# Altium project Beta_Prototype_Main_Board.PrjPcb (part 1 of 2)
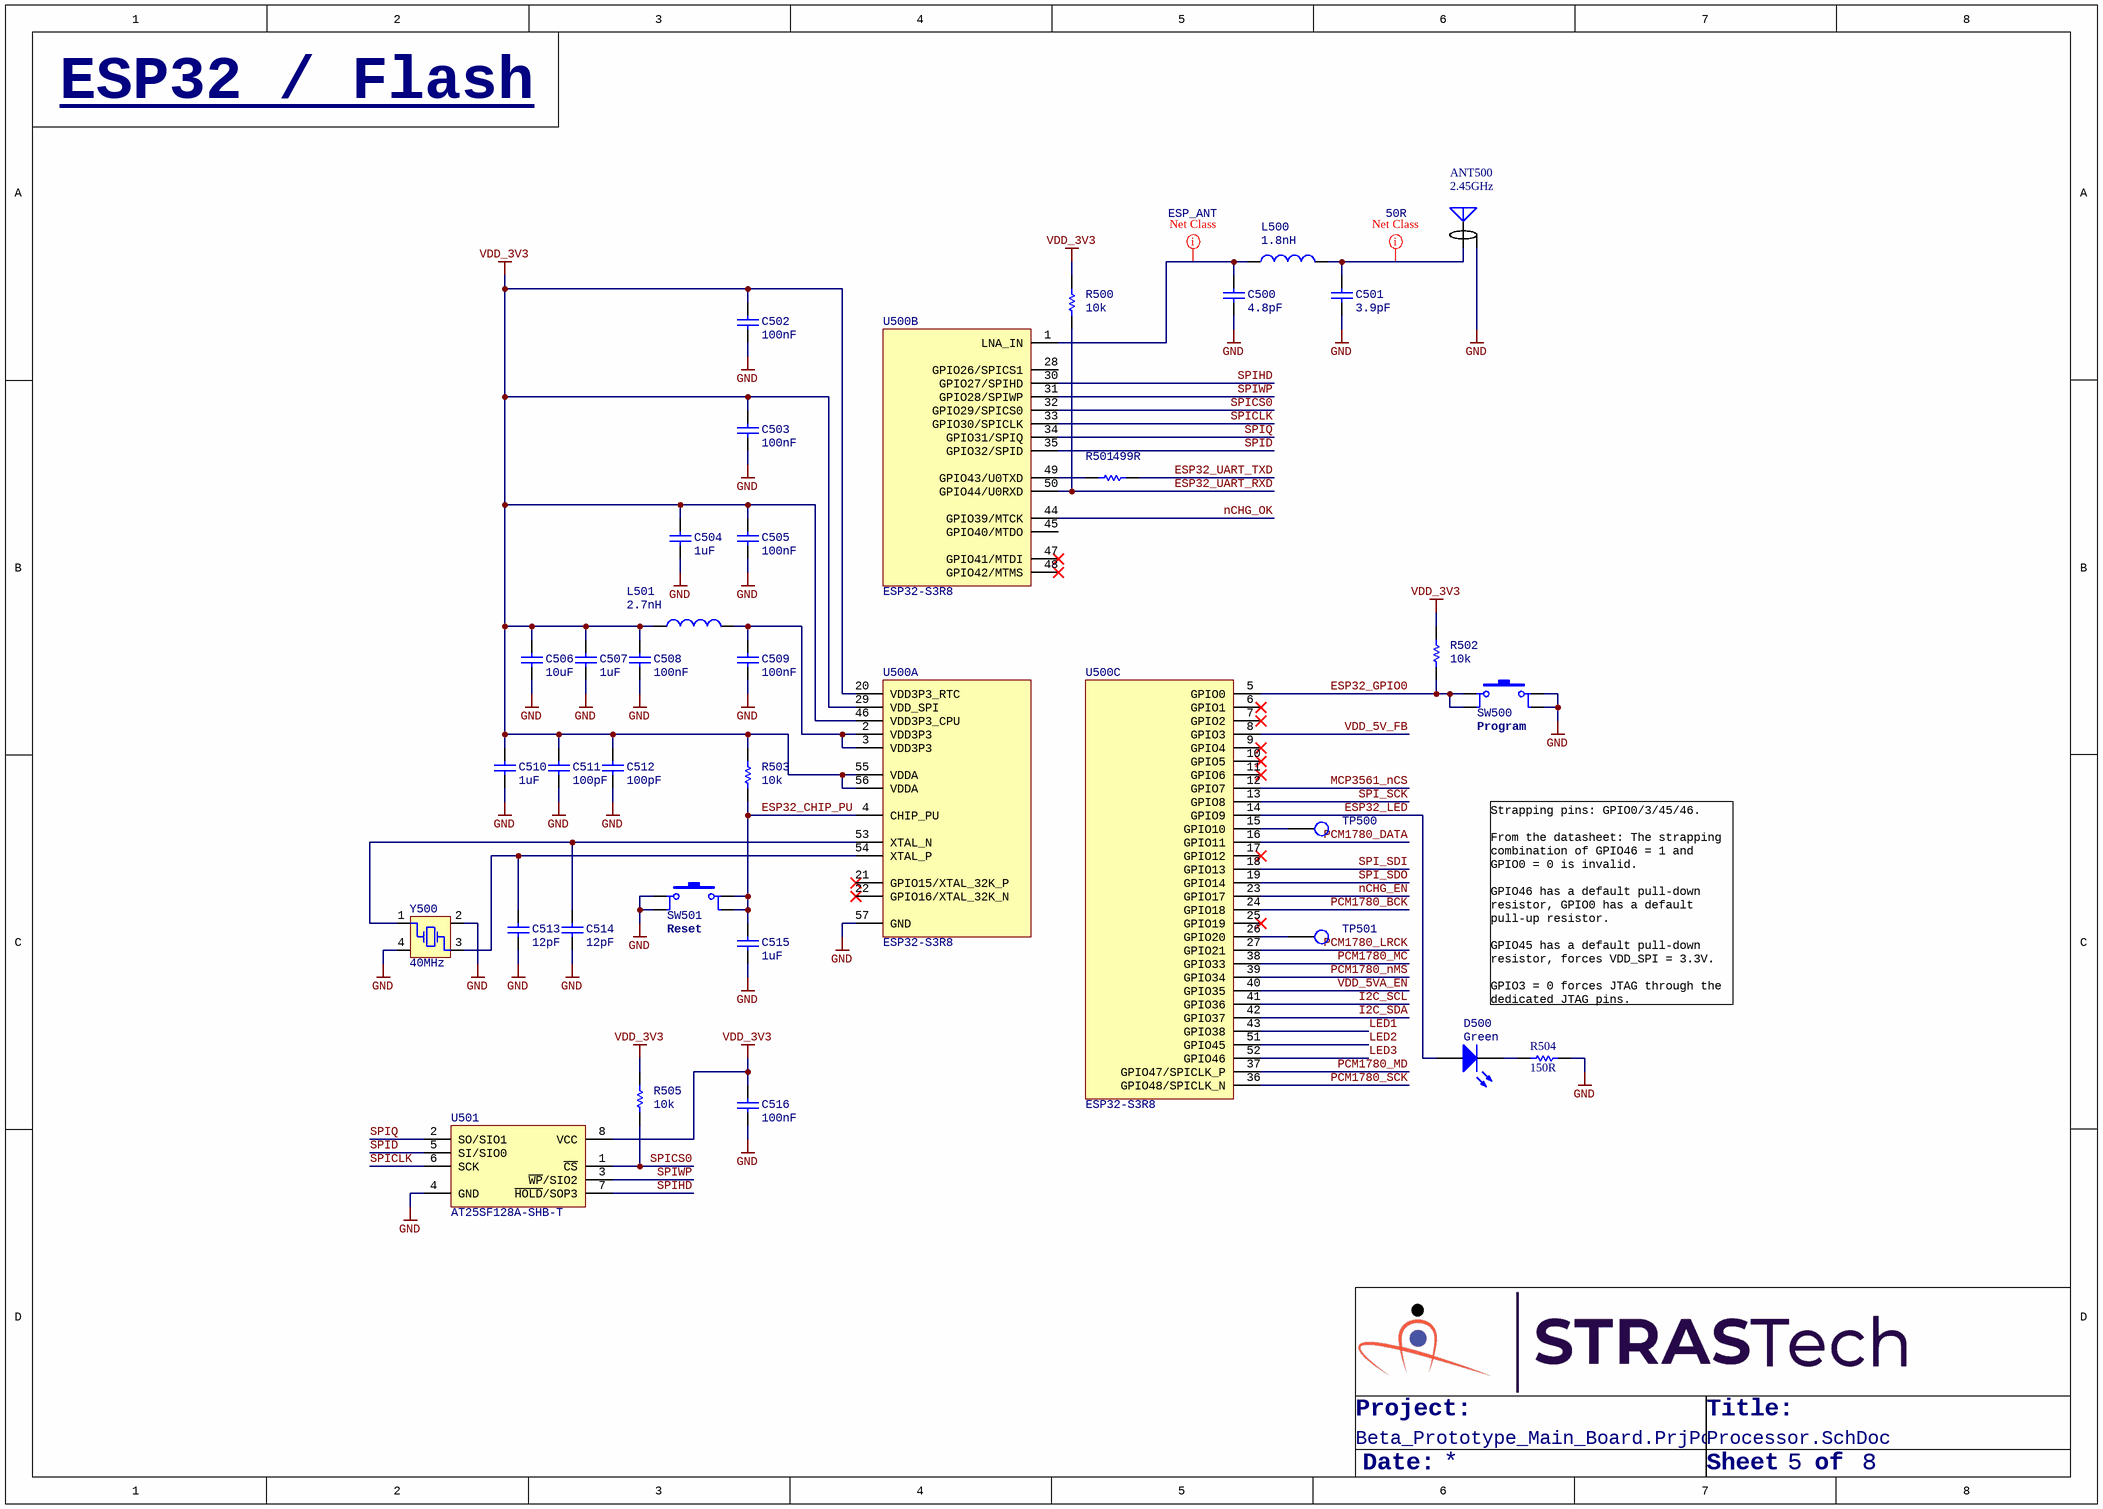
[diagram p0: Processor.SchDoc]
8 sheets, 249 parts. Net scope: global (net labels, ports and power ports of the same name join across sheets).
Board file: Main_Board.PcbDoc
Sheets:
  Processor.SchDoc
  USB_Serial.SchDoc
  Load_Cell_Biasing.SchDoc
  Load_Cell_Acquisition.SchDoc
  Inertial_Measurement_RTC.SchDoc
  Peripherals_Main_Board.SchDoc
  Regulation_Charging.SchDoc
  ShinStrap_Interface.SchDoc

## Sheet Processor.SchDoc
size A3; Organization: Altium Limited; Address1: L3, 12a Rodborough Rd; Address2: Frenchs Forest; Address3: NSW; Address4: Australia 2086; DocumentNumber: 5; SheetNumber: 5; SheetTotal: 8

### Parts
ANT500  2.45GHz  [ANT,PCB,IFA,2.45GHZ]
C500  4.8pF  [Cap,SMD,0402]
C501  3.9pF  [Cap,SMD,0402]
C502  100nF  [Cap,SMD,0402]
C503  100nF  [Cap,SMD,0402]
C504  1uF  [Cap,SMD,0402]
C505  100nF  [Cap,SMD,0402]
C506  10uF  [Cap,SMD,0402]
C507  1uF  [Cap,SMD,0402]
C508  100nF  [Cap,SMD,0402]
C509  100nF  [Cap,SMD,0402]
C510  1uF  [Cap,SMD,0402]
C511  100pF  [Cap,SMD,0402]
C512  100pF  [Cap,SMD,0402]
C513  12pF  [Cap,SMD,0402]
C514  12pF  [Cap,SMD,0402]
C515  1uF  [Cap,SMD,0402]
C516  100nF  [Cap,SMD,0402]
D500  Green  [LED,0603]
L500  1.8nH  [ind,0402]
L501  2.7nH  [ind,0402]
R500  10k  [RES,0402]
R501  499R  [RES,0402]
R502  10k  [RES,0402]
R503  10k  [RES,0402]
R504  150R  [RES,0402]
R505  10k  [RES,0402]
SW500  Switch  [Switch,Tactile,Micro,SPST-NO,SMD]  (value not drawn)
SW501  Switch  [Switch,Tactile,Micro,SPST-NO,SMD]  (value not drawn)
TP500  TESTPOINT  [testpoint,smd,round,1mm]  (value not drawn)
TP501  TESTPOINT  [testpoint,smd,round,1mm]  (value not drawn)
U500  ESP32-S3R8  [IC,QFN-56,7X7,P0.4MM]  (parts A,B,C of 3)
U501  AT25SF128A-SHB-T  [IC,SOIC-8,1.27mm,W5.28]
Y500  40MHz  [XTAL,SMD,4 Pin,2x2.5mm]

### Nets
GND: ANT500.2 C500.1 C501.1 C502.1 C503.1 C504.1 C505.1 C506.1 C507.1 C508.1 C509.1 C510.1 C511.1 C512.1 C513.2 C514.2 C515.1 C516.1 R504.2 SW500.3 SW500.4 SW501.1 SW501.2 U500.57(GND) U501.4(GND) Y500.2(GND) Y500.4(GND)
VDD_3V3: C502.2 C503.2 C504.2 C505.2 C506.2 C507.2 C508.2 C510.2 C511.2 C512.2 C516.2 L501.1 R500.2 R502.1 R503.1 R505.2 U500.20(VDD3P3_RTC) U500.29(VDD_SPI) U500.46(VDD3P3_CPU) U500.55(VDDA) U500.56(VDDA) U501.8(VCC)
ESP32_CHIP_PU: C515.2 R503.2 SW501.3 SW501.4 U500.4(CHIP_PU)
ESP32_GPIO0: R502.2 SW500.1 SW500.2 U500.5(GPIO0)
ESP32_LED: D500.1(A) U500.14(GPIO9)
ESP32_UART_RXD: R500.1 U500.50(GPIO44/U0RXD)
ESP32_UART_TXD: R501.2
I2C_SCL: U500.41(GPIO36)
I2C_SDA: U500.42(GPIO37)
LED1: U500.43(GPIO38)
LED2: U500.51(GPIO45)
LED3: U500.52(GPIO46)
MCP3561_nCS: U500.12(GPIO7)
nCHG_EN: U500.23(GPIO17)
nCHG_OK: U500.44(GPIO39/MTCK)
PCM1780_BCK: U500.24(GPIO18)
PCM1780_DATA: U500.16(GPIO11)
PCM1780_LRCK: U500.27(GPIO21)
PCM1780_MC: U500.38(GPIO33)
PCM1780_MD: U500.37(GPIO47/SPICLK_P)
PCM1780_nMS: U500.39(GPIO34)
PCM1780_SCK: U500.36(GPIO48/SPICLK_N)
SPI_SCK: U500.13(GPIO8)
SPI_SDI: U500.18(GPIO13)
SPI_SDO: U500.19(GPIO14)
SPICLK: U500.33(GPIO30/SPICLK) U501.6(SCK)
SPICS0: R505.1 U500.32(GPIO29/SPICS0) U501.1(~{CS})
SPID: U500.35(GPIO32/SPID) U501.5(SI/SIO0)
SPIHD: U500.30(GPIO27/SPIHD) U501.7(~{HOLD}/SOP3)
SPIQ: U500.34(GPIO31/SPIQ) U501.2(SO/SIO1)
SPIWP: U500.31(GPIO28/SPIWP) U501.3(~{WP}/SIO2)
VDD_5V_FB: U500.8(GPIO3)
VDD_5VA_EN: U500.40(GPIO35)
NetANT500_1: ANT500.1 C501.2 L500.2
NetC500_2: C500.2 L500.1 U500.1(LNA_IN)
NetC509_2: C509.2 L501.2 U500.2(VDD3P3) U500.3(VDD3P3)
NetC513_1: C513.1 U500.54(XTAL_P) Y500.3(OSC2)
NetC514_1: C514.1 U500.53(XTAL_N) Y500.1(OSC1)
NetD500_2: D500.2(K) R504.1
NetR501_1: R501.1 U500.49(GPIO43/U0TXD)
NetTP500_1: TP500.1(TP) U500.15(GPIO10)
NetTP501_1: TP501.1(TP) U500.26(GPIO20)

Not connected (* = marked no-connect by the designer): U500 6(GPIO1)* 7(GPIO2)* 9(GPIO4)* 10(GPIO5)* 11(GPIO6)* 17(GPIO12)* 21(GPIO15/XTAL_32K_P)* 22(GPIO16/XTAL_32K_N)* 25(GPIO19)* 28(GPIO26/SPICS1) 45(GPIO40/MTDO) 47(GPIO41/MTDI)* 48(GPIO42/MTMS)*

### Layout directives
net class ESP_ANT: NetC500_2
net class 50R: NetANT500_1

### Notes on the sheet
- ESP32 / Flash
- (near SW500) Program
- (near SW501) Reset
- Strapping pins: GPIO0/3/45/46.
  From the datasheet: The strapping combination of GPIO46 = 1 and GPIO0 = 0 is invalid.
  GPIO46 has a default pull-down resistor, GPIO0 has a default pull-up resistor.
  GPIO45 has a default pull-down resistor, forces VDD_SPI = 3.3V.
  GPIO3 = 0 forces JTAG through the dedicated JTAG pins.
- Project:
- Title:
- Date:
- Sheet
- of
- Title
- Size:
- A3
- Revision:
- Design By:

### Library data of the parts
ANT500 = ANT,2.45GHz,IFA,PCB: 2.4-GHz Inverted F Antenna; HelpURL: https://www.ti.com/lit/an/swru120d/swru120d.pdf?ts=1646240772720&ref_url=https%253A%252F%252Fwww.google.com%252F; CreatedBy: Judd Foster; Manufacturer: N/A; Manufacturer Part Number: N/A; Vendor: N/A; Vendor Part Number: N/A
C500 = CAP,Cer,4.8pF,50VDC,C0G/NP0,0402: 4.8 pF ±0.25pF 50V Ceramic Capacitor C0G, NP0 0402 (1005 Metric); Vendor Part Number: 490-17481-1-ND; Manufacturer: Murata Electronics; Manufacturer Part Number: GCQ1555C1H4R8CB01D; Vendor: Digikey; HelpURL: https://search.murata.co.jp/Ceramy/image/img/A01X/G101/ENG/GCQ1555C1H4R8CB01-01.pdf; CreatedBy: Judd Foster
C501 = CAP,Cer,3.9pF,50VDC,C0G/NP0,0402: 3.9 pF ±0.1pF 50V Ceramic Capacitor C0G, NP0 0402 (1005 Metric); Vendor Part Number: 399-CBR04C399B5GACCT-ND; Manufacturer: KEMET; Manufacturer Part Number: CBR04C399B5GAC; Vendor: Digikey; HelpURL: https://api.kemet.com/component-edge/download/datasheet/CBR04C399B5GAC.pdf; CreatedBy: Judd Foster
C502 C503 C505 C508 C509 C516 = CAP,Cer,100nF,25VDC,X7R,0402: 0.1µF ±10% 25V Ceramic Capacitor X7R 0402 (1005 Metric); Vendor Part Number: 490-14603-1-ND; Manufacturer: Murata Electronics; Manufacturer Part Number: GRM155R71E104KE14J; Vendor: Digikey; HelpURL: https://search.murata.co.jp/Ceramy/image/img/A01X/G101/ENG/GRM155R71E104KE14-01.pdf; CreatedBy: Judd Foster
C504 C507 C510 = CAP,Cer,1uF,35VDC,X5R,0402: 1 µF ±10% 35V Ceramic Capacitor X5R 0402 (1005 Metric); Vendor Part Number: 445-9073-1-ND; Manufacturer: TDK Corporation; Manufacturer Part Number: C1005X5R1V105K050BC; Vendor: Digikey; HelpURL: https://product.tdk.com/info/en/catalog/datasheets/mlcc_commercial_general_en.pdf?ref_disty=digikey; CreatedBy: Judd Foster
C506 = CAP,Cer,10uF,10VDC,X5R,0402: 10 µF ±20% 10V Ceramic Capacitor X5R 0402 (1005 Metric); Vendor Part Number: 1276-1450-1-ND; Manufacturer: Samsung Electro-Mechanics; Manufacturer Part Number: CL05A106MP5NUNC; Vendor: Digikey; HelpURL: https://media.digikey.com/pdf/Data%20Sheets/Samsung%20PDFs/CL05A106MP5NUNC_Spec.pdf; CreatedBy: Judd Foster
C511 C512 = CAP,Cer,100pF,50VDC,C0G/NP0,0402: 100pF ±5% 50V Ceramic Capacitor C0G, NP0 0402 (1005 Metric); Vendor Part Number: 490-10669-1-ND; Manufacturer: Murata Electronics; Manufacturer Part Number: GCM1555C1H101JA16D; Vendor: Digikey; HelpURL: https://www.murata.com/~/media/webrenewal/support/library/catalog/products/capacitor/mlcc/c03e.ashx?la=en-us; CreatedBy: Judd Foster
C513 C514 = CAP,Cer,12pF,50VDC,C0G/NP0,0402: 12pF ±5% 50V Ceramic Capacitor C0G, NP0 0402 (1005 Metric); Vendor Part Number: 311-1016-1-ND; Manufacturer: Yageo; Manufacturer Part Number: CC0402JRNPO9BN120; Vendor: Digikey; HelpURL: https://www.yageo.com/upload/media/product/productsearch/datasheet/mlcc/UPY-GP_NP0_16V-to-50V_18.pdf; CreatedBy: Judd Foster
C515 = CAP,Cer,1uF,6.3VDC,X5R,0402: 1µF ±20% 6.3V Ceramic Capacitor X5R 0402 (1005 Metric); Vendor Part Number: 1276-1235-1-ND; Manufacturer: Samsung Electro-Mechanics; Manufacturer Part Number: CL05A105MQ5NNNC; Vendor: Digikey; HelpURL: https://media.digikey.com/pdf/Data%20Sheets/Samsung%20PDFs/CL_Series_MLCC_ds.pdf; CreatedBy: Judd Foster
D500 = LED,Green,SMD,0603: Green 530nm LED Indication - Discrete 3V 0603 (1608 Metric); Manufacturer: Stanley Electric Co; Manufacturer Part Number: THG1111C-0005-TR; Vendor Part Number: 404-1286-1-ND; Vendor: Digikey; CreatedBy: Judd Foster; HelpURL: http://www.stanley-components.com/php/downloaddatafile.php?rp=0,THG1111C-0005_e.pdf
L500 = IND,1.8nH,900mA,Multilayer,0402: 1.8 nH Unshielded Multilayer Inductor 900 mA 100mOhm Max 0402 (1005 Metric); Vendor Part Number: 490-1076-1-ND; Manufacturer: Murata Electronics; Manufacturer Part Number: LQG15HN1N8S02D; Vendor: Digikey; HelpURL: https://search.murata.co.jp/Ceramy/image/img/P02/JELF243B-0009.pdf; CreatedBy: Judd Foster
L501 = IND,2.7nH,800mA,Multilayer,0402: 2.7nH Unshielded Multilayer Inductor 800mA 150mOhm Max 0402 (1005 Metric); Vendor Part Number: 490-2615-1-ND; Manufacturer: Murata Electronics; Manufacturer Part Number: LQG15HS2N7S02D; Vendor: Digikey; HelpURL: https://psearch.en.murata.com/inductor/product/LQG15HS2N7S02_.pdf; CreatedBy: Judd Foster
R500 R502 R503 R505 = RES,10k,5%,0.063W,0402: 10 kOhms ±5% 0.063W, 1/16W Chip Resistor 0402 (1005 Metric) Automotive AEC-Q200 Thick Film; Vendor Part Number: RMCF0402JT10K0CT-ND; Manufacturer: Stackpole Electronics Inc; Manufacturer Part Number: RMCF0402JT10K0; Vendor: DIgikey; HelpURL: https://www.seielect.com/catalog/sei-rmcf_rmcp.pdf; CreatedBy: Judd Foster
R501 = RES,499R,1%,0.063W,0402: 499 Ohms ±1% 0.063W, 1/16W Chip Resistor 0402 (1005 Metric) Automotive AEC-Q200 Thick Film; Manufacturer: Stackpole Electronics Inc; Manufacturer Part Number: RMCF0402FT499R; Vendor Part Number: RMCF0402FT499RCT-ND; Vendor: Digikey; CreatedBy: Judd Foster; HelpURL: https://www.seielect.com/catalog/sei-rmcf_rmcp.pdf
R504 = RES,150R,1%,0.1W,0402: 150 Ohms ±1% 0.063W, 1/16W Chip Resistor 0402 (1005 Metric) Automotive AEC-Q200, Moisture Resistant Thick Film; Manufacturer: TE Connectivity Passive Product; Manufacturer Part Number: CRGCQ0402F150R; Vendor Part Number: A129617CT-ND; Vendor: Digikey; CreatedBy: Judd Foster; HelpURL: https://www.te.com/commerce/DocumentDelivery/DDEController?Action=srchrtrv&DocNm=1773204-3&DocType=DS&DocLang=English
SW500 SW501 = Switch,Tactile,SPST-NO,SMD,H1.5: Tactile Switch SPST-NO Top Actuated Surface Mount; Manufacturer: C&K; Manufacturer Part Number: PTS525SM15SMTR2 LFS; Vendor Part Number: CKN9104CT-ND; Vendor: Digikey; CreatedBy: Judd Foster; HelpURL: https://www.ckswitches.com/media/1467/pts525.pdf
TP500 TP501 = TESTPOINT: PCB Testpoint; CreatedBy: Judd Foster; HelpURL: N/A; Manufacturer: N/A; Manufacturer Part Number: N/A; Vendor: N/A; Vendor Part Number: N/A
U500 = ESP32-S3R8: IC RF TxRx + MCU Bluetooth, WiFi 802.11b/g/n, Bluetooth v5.0 2.412GHz ~ 2.484GHz 56-VFQFN Exposed Pad; Manufacturer: Espressif Systems; Vendor Part Number: 1904-ESP32-S3R8-ND; Vendor: Digikey; CreatedBy: Judd Foster; HelpURL: https://www.espressif.com/sites/default/files/documentation/esp32-s3_datasheet_en.pdf; Manufacturer Part Number: ESP32-S3R8
U501 = AT25SF128A-SHB-T: FLASH - NOR Memory IC 128Mb (16M x 8) SPI - Quad I/O 133 MHz 8-SOIC; Manufacturer: Adesto Technologies; Vendor Part Number: 1265-1348-1-ND; Vendor: Digikey; CreatedBy: Judd Foster; HelpURL: https://www.dialog-semiconductor.com/sites/default/files/2021-02/DS-AT25SF128A-168.pdf; Manufacturer Part Number: AT25SF128A-SHB-T
Y500 = XTAL,40MHz,12pF,SMD: 40 MHz ±7ppm Crystal 12pF 25 Ohms 4-SMD, No Lead; Manufacturer: Hosonic Electronic Co., Ltd; Manufacturer Part Number: E2SB40E000104E; Vendor Part Number: 3186-E2SB40E000104ECT-ND; Vendor: Digikey; CreatedBy: Judd Foster; HelpURL: https://ecsxtal.com/store/pdf/ECS-33B.pdf

## Sheet USB_Serial.SchDoc
size A3; Organization: Altium Limited; Address1: L3, 12a Rodborough Rd; Address2: Frenchs Forest; Address3: NSW; Address4: Australia 2086; DocumentNumber: 8; SheetNumber: 8; SheetTotal: 8
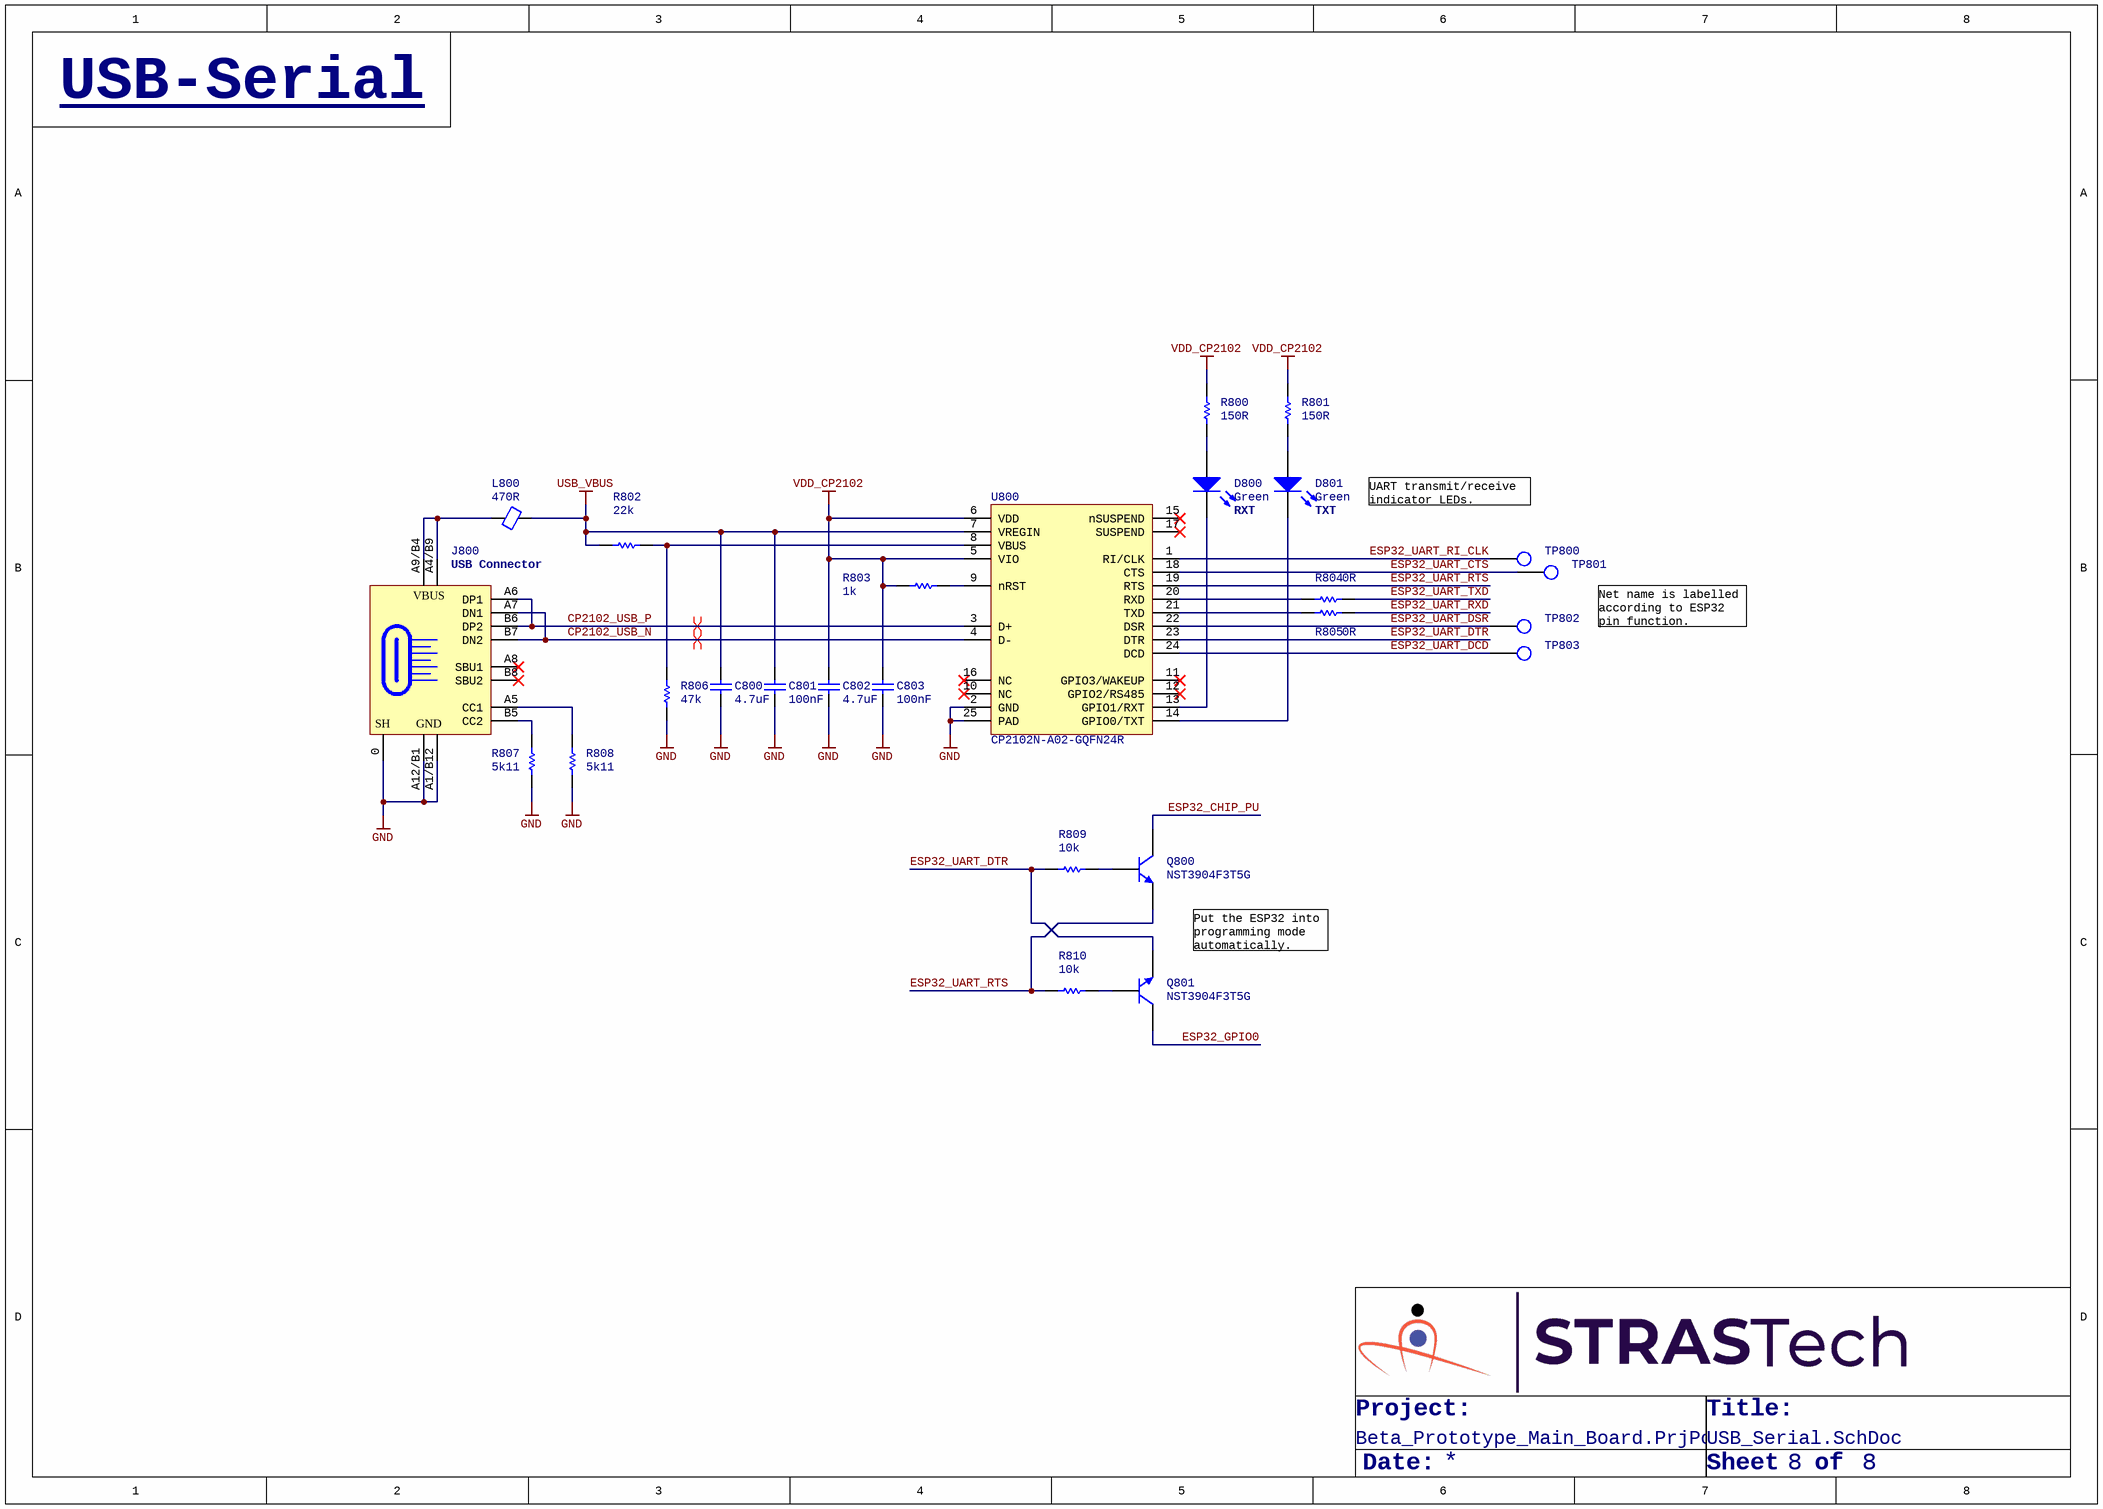
[diagram p1: USB_Serial.SchDoc]

### Parts
C800  4.7uF  [Cap,SMD,0402]
C801  100nF  [Cap,SMD,0402]
C802  4.7uF  [Cap,SMD,0402]
C803  100nF  [Cap,SMD,0402]
D800  Green  [LED,0603]
D801  Green  [LED,0603]
J800  USB  [CONN,USB_C,SMD]  (value not drawn)
L800  470R  [IND,0402]
Q800  NST3904F3T5G  [SOT1123]
Q801  NST3904F3T5G  [SOT1123]
R800  150R  [RES,0402]
R801  150R  [RES,0402]
R802  22k  [RES,0402]
R803  1k  [RES,0402]
R804  0R  [RES,0402]
R805  0R  [RES,0402]
R806  47k  [RES,0402]
R807  5k11  [RES,0402]
R808  5k11  [RES,0402]
R809  10k  [RES,0402]
R810  10k  [RES,0402]
TP800  TESTPOINT  [testpoint,smd,round,1mm]  (value not drawn)
TP801  TESTPOINT  [testpoint,smd,round,1mm]  (value not drawn)
TP802  TESTPOINT  [testpoint,smd,round,1mm]  (value not drawn)
TP803  TESTPOINT  [testpoint,smd,round,1mm]  (value not drawn)
U800  CP2102N-A02-GQFN24R  [IC,VQFN-24,THERMAL,4x4]

### Nets
GND: C800.1 C801.1 C802.1 C803.1 J800.0(SHIELD) J800.A1/B12(GND) J800.A12/B1(GND) R806.1 R807.1 R808.1 U800.2(GND) U800.25(PAD)
USB_VBUS: C800.2 C801.2 L800.2 R802.1 U800.7(VREGIN)
VDD_CP2102: C802.2 C803.2 R800.2 R801.2 R803.2 U800.5(VIO) U800.6(VDD)
CP2102_USB_N: J800.A7(DN1) J800.B7(DN2) U800.4(D-)
CP2102_USB_P: J800.A6(DP1) J800.B6(DP2) U800.3(D+)
ESP32_CHIP_PU: Q800.3(C)
ESP32_GPIO0: Q801.3(C)
ESP32_UART_CTS: TP801.1(TP) U800.18(CTS)
ESP32_UART_DCD: TP803.1(TP) U800.24(DCD)
ESP32_UART_DSR: TP802.1(TP) U800.22(DSR)
ESP32_UART_DTR: Q801.2(E) R809.2 U800.23(DTR)
ESP32_UART_RI_CLK: TP800.1(TP) U800.1(RI/CLK)
ESP32_UART_RTS: Q800.2(E) R810.2 U800.19(RTS)
ESP32_UART_RXD: R805.2
ESP32_UART_TXD: R804.2
NetD800_1: D800.1(A) R800.1
NetD800_2: D800.2(K) U800.13(GPIO1/RXT)
NetD801_1: D801.1(A) R801.1
NetD801_2: D801.2(K) U800.14(GPIO0/TXT)
NetJ800_A4/B9: J800.A4/B9(VBUS) J800.A9/B4(VBUS) L800.1
NetJ800_A5: J800.A5(CC1) R808.2
NetJ800_B5: J800.B5(CC2) R807.2
NetQ800_1: Q800.1(B) R809.1
NetQ801_1: Q801.1(B) R810.1
NetR802_2: R802.2 R806.2 U800.8(VBUS)
NetR803_1: R803.1 U800.9(nRST)
NetR804_1: R804.1 U800.20(RXD)
NetR805_1: R805.1 U800.21(TXD)

Not connected (* = marked no-connect by the designer): J800 A8(SBU1)* B8(SBU2)*; U800 10(NC)* 11(GPIO3/WAKEUP)* 12(GPIO2/RS485)* 15(nSUSPEND)* 16(NC)* 17(SUSPEND)*

### Layout directives
differential pair: CP2102_USB_N, CP2102_USB_P

### Notes on the sheet
- USB-Serial
- RXT
- (near D801) TXT
- UART transmit/receive indicator LEDs.
- (near J800) USB Connector
- Net name is labelled according to ESP32 pin function.
- Put the ESP32 into programming mode automatically.
- Project:
- Title:
- Date:
- Sheet
- of
- Title
- Size:
- A3
- Revision:
- Design By:
- (in symbol Conn,USB_C,SMD) SH

### Library data of the parts
C800 C802 = CAP,Cer,4.7uF,16VDC,X5R,0402: 4.7 µF ±20% 16V Ceramic Capacitor X5R 0402 (1005 Metric); Vendor Part Number: 478-10788-1-ND; Manufacturer: AVX Corporation; Manufacturer Part Number: 0402YD475MAT2A; Vendor: Digikey; HelpURL: https://datasheets.avx.com/cx5r.pdf; CreatedBy: Judd Foster
C801 C803 = CAP,Cer,100nF,25VDC,X7R,0402: as C502 on sheet Processor; HelpURL: https://search.murata.co.jp/Ceramy/image/img/A01X/G101/ENG/GRM155R71E104KE14-01.pdf; CreatedBy: Judd Foster
D800 D801 = LED,Green,SMD,0603: as D500 on sheet Processor; CreatedBy: Judd Foster; HelpURL: http://www.stanley-components.com/php/downloaddatafile.php?rp=0,THG1111C-0005_e.pdf
J800 = Conn,USB_C,SMD: USB-C (USB TYPE-C) USB 2.0 Receptacle Connector 24 (16+8 Dummy) Position Surface Mount, Right Angle; Manufacturer: GCT; Manufacturer Part Number: USB4110-GF-A; Vendor Part Number: 2073-USB4110-GF-A-1-ND; Vendor: Digikey; CreatedBy: Judd Foster; HelpURL: https://gct.co/files/drawings/usb4110.pdf
L800 = Ferrite,470R@100MHz,0402: 470 Ohms @ 100 MHz 1 Power Line Ferrite Bead 0402 (1005 Metric) 1A 200mOhm; Vendor Part Number: 490-10662-1-ND; Manufacturer: Murata Electronics; Manufacturer Part Number: BLM15PX471SN1D; Vendor: Digikey; HelpURL: https://www.murata.com/en-us/products/productdata/8796740059166/ENFA0018.pdf; CreatedBy: Judd Foster
Q800 Q801 = Trans,NPN,40V,200mA,SOT1123: Bipolar (BJT) Transistor NPN 40 V 200 mA 200MHz 290 mW Surface Mount SOT-1123; Manufacturer: ON Semiconductor; Vendor Part Number: NST3904F3T5GOSCT-ND; Vendor: Digikey; CreatedBy: Judd Foster; HelpURL: https://www.onsemi.com/pdf/datasheet/nst3904f3-d.pdf; Manufacturer Part Number: NST3904F3T5G
R800 R801 = RES,150R,1%,0.1W,0402: as R504 on sheet Processor; CreatedBy: Judd Foster; HelpURL: https://www.te.com/commerce/DocumentDelivery/DDEController?Action=srchrtrv&DocNm=1773204-3&DocType=DS&DocLang=English
R802 = RES,22k,1%,0.063W,0402: 22 kOhms ±1% 0.063W, 1/16W Chip Resistor 0402 (1005 Metric) Automotive AEC-Q200 Thick Film; Vendor Part Number: RMCF0402FT22K0CT-ND; Manufacturer: Stackpole Electronics Inc; Manufacturer Part Number: RMCF0402FT22K0; Vendor: DIgikey; HelpURL: https://www.seielect.com/catalog/sei-rmcf_rmcp.pdf; CreatedBy: Judd Foster
R803 = RES,1k,5%,0.063W,0402: 1 kOhms ±5% 0.063W, 1/16W Chip Resistor 0402 (1005 Metric) Automotive AEC-Q200 Thick Film; Vendor Part Number: RMCF0402JT1K00CT-ND; Manufacturer: Stackpole Electronics Inc; Manufacturer Part Number: RMCF0402JT1K00; Vendor: DIgikey; HelpURL: https://www.seielect.com/catalog/sei-rmcf_rmcp.pdf; CreatedBy: Judd Foster
R804 R805 = RES,0R0,0.1W,0402: 0 Ohms Jumper 0.1W, 1/10W Chip Resistor 0402 (1005 Metric) Automotive AEC-Q200 Thick Film; Manufacturer: Panasonic Electronic Components; Manufacturer Part Number: ERJ-2GE0R00X; Vendor Part Number: P0.0JCT-ND; Vendor: Digikey; CreatedBy: Judd Foster; HelpURL: https://industrial.panasonic.com/cdbs/www-data/pdf/RDA0000/AOA0000C301.pdf
R806 = RES,47k,1%,0.1W,0402: 47 kOhms ±1% 0.1W, 1/10W Chip Resistor 0402 (1005 Metric) Automotive AEC-Q200 Thick Film; Manufacturer: Panasonic Electronic Components; Manufacturer Part Number: ERJ-2RKF4702X; Vendor Part Number: P47.0KLCT-ND; Vendor: Digikey; CreatedBy: Judd Foster; HelpURL: https://industrial.panasonic.com/cdbs/www-data/pdf/RDA0000/AOA0000C304.pdf
R807 R808 = RES,5k11,1%,0.063W,0402: 5.11 kOhms ±1% 0.063W, 1/16W Chip Resistor 0402 (1005 Metric) Automotive AEC-Q200, Moisture Resistant Thick Film; Manufacturer: Yageo; Manufacturer Part Number: AC0402FR-075K11L; Vendor Part Number: 13-AC0402FR-075K11LCT-ND; Vendor: Digikey; CreatedBy: Judd Foster; HelpURL: https://www.yageo.com/upload/media/product/productsearch/datasheet/rchip/PYu-AC_51_RoHS_L_7.pdf
R809 R810 = RES,10k,5%,0.063W,0402: as R500 on sheet Processor; HelpURL: https://www.seielect.com/catalog/sei-rmcf_rmcp.pdf; CreatedBy: Judd Foster
TP800-TP803 = TESTPOINT: PCB Testpoint; CreatedBy: Judd Foster; HelpURL: N/A; Manufacturer: N/A; Manufacturer Part Number: N/A; Vendor: N/A; Vendor Part Number: N/A
U800 = CP2102N-A02-GQFN24R: USB Bridge, USB to UART USB 2.0 UART Interface 24-QFN (4x4); Manufacturer: Silicon Labs; Vendor Part Number: 336-5888-1-ND; Vendor: Digikey; CreatedBy: Judd Foster; HelpURL: https://www.silabs.com/documents/public/data-sheets/cp2102n-datasheet.pdf; Manufacturer Part Number: CP2102N-A02-GQFN24R

## Sheet Load_Cell_Biasing.SchDoc
size A3; Organization: Altium Limited; Address1: L3, 12a Rodborough Rd; Address2: Frenchs Forest; Address3: NSW; Address4: Australia 2086; DocumentNumber: 3; SheetNumber: 3; SheetTotal: 8
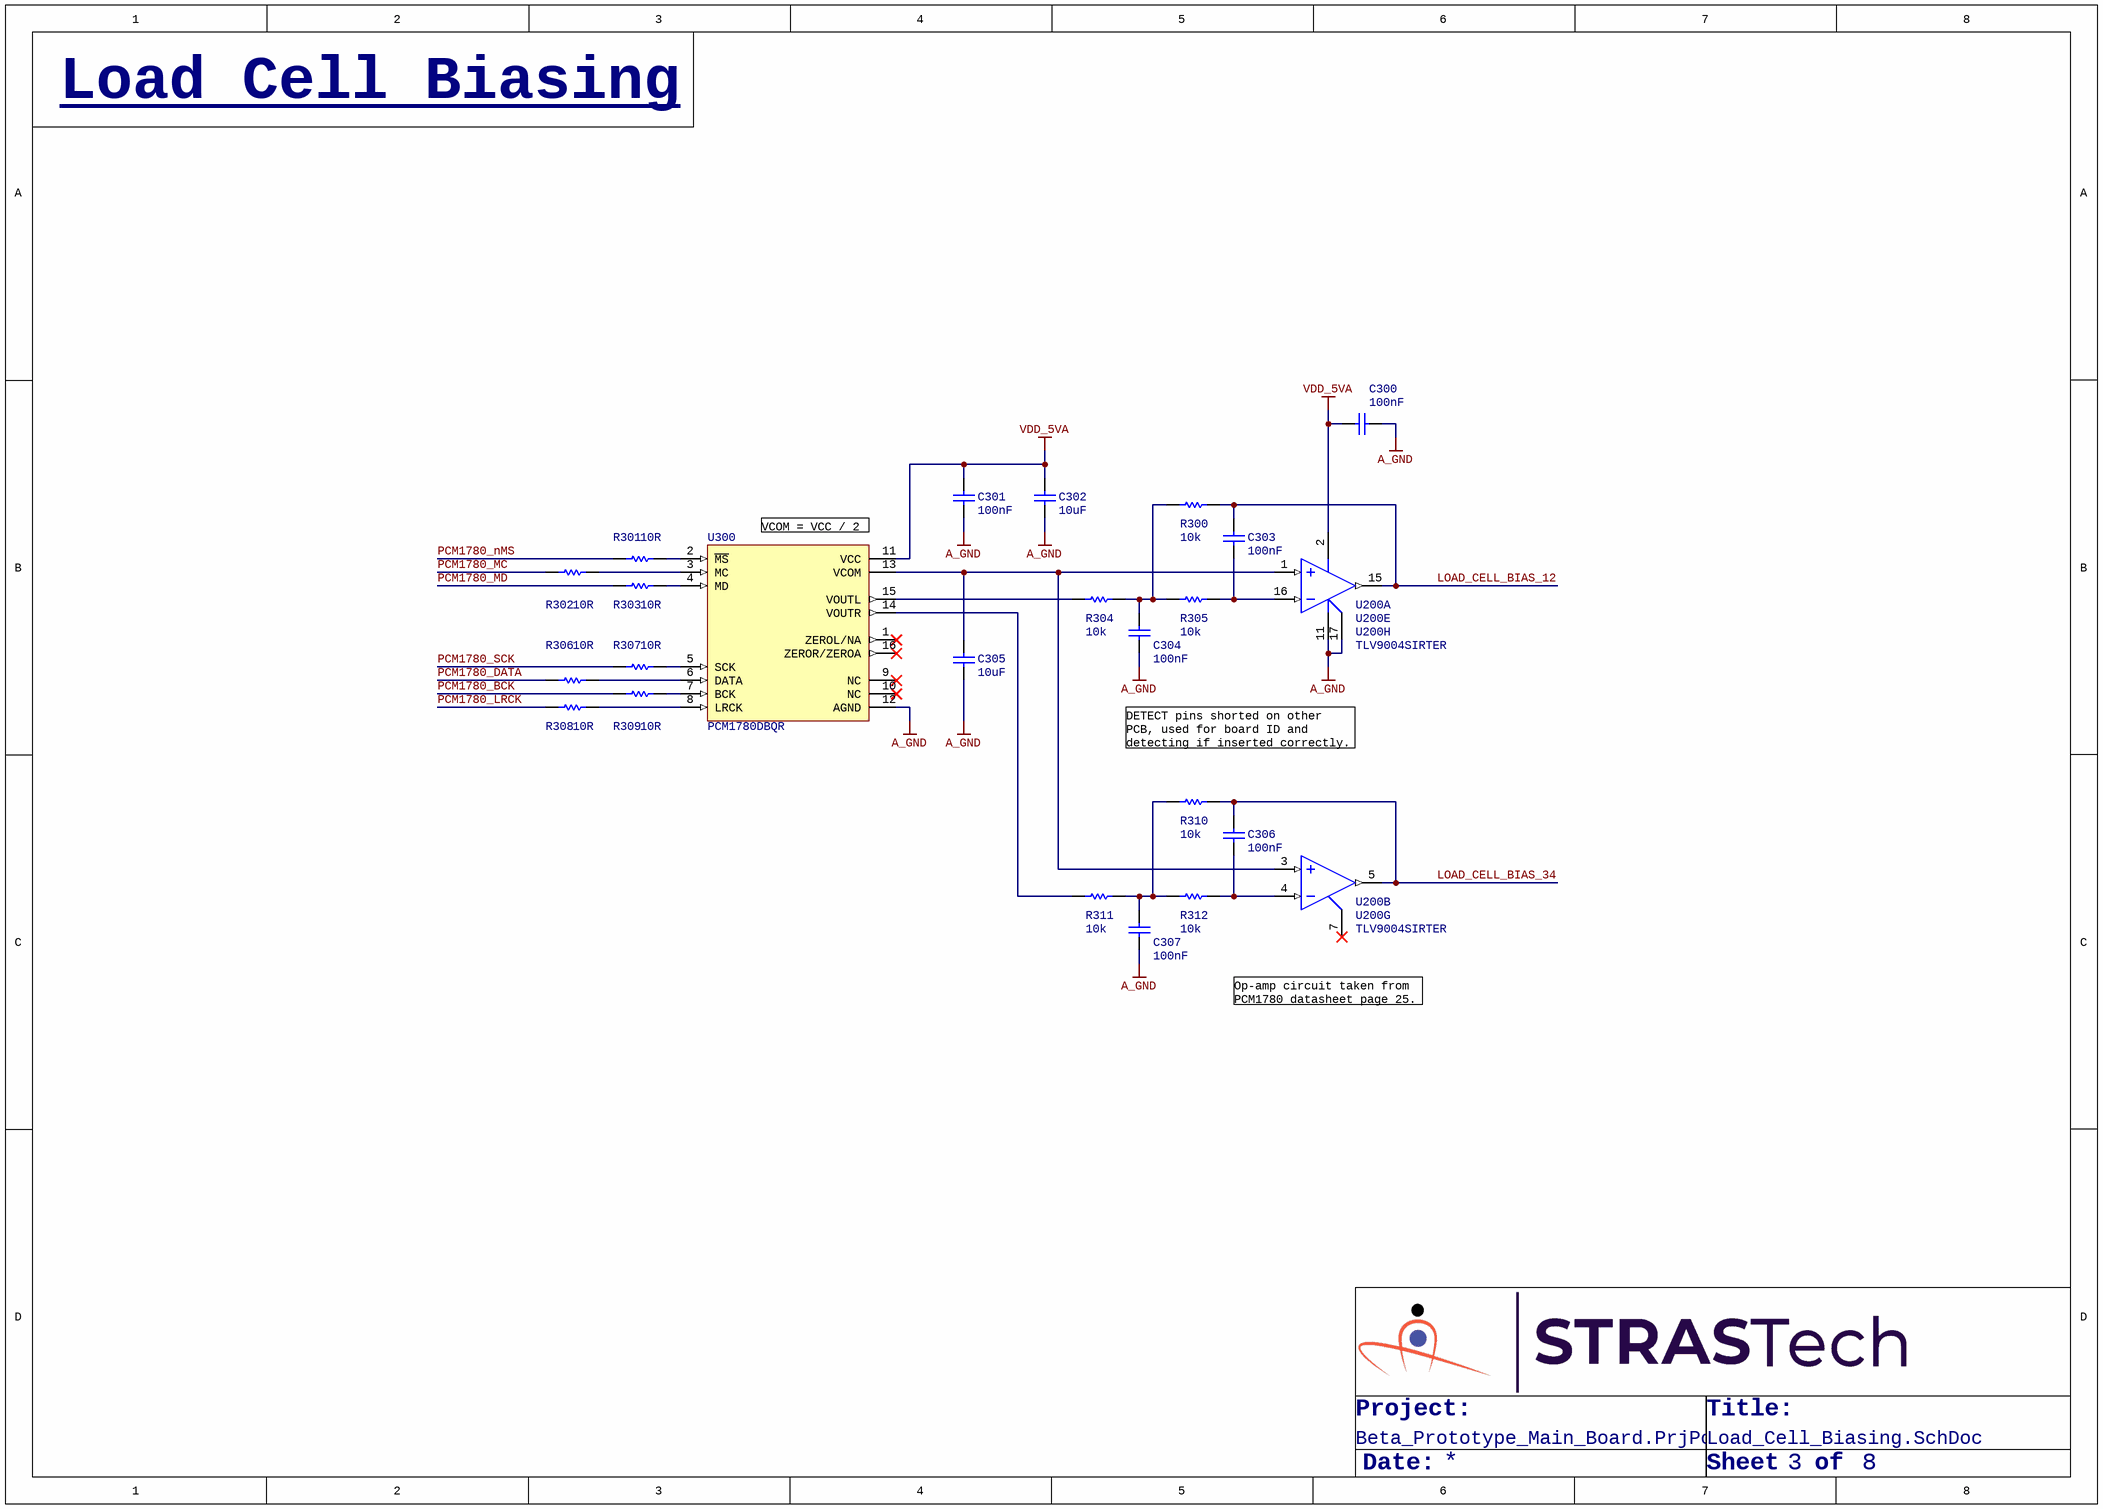
[diagram p2: Load_Cell_Biasing.SchDoc]

### Parts
C300  100nF  [Cap,SMD,0402]
C301  100nF  [Cap,SMD,0402]
C302  10uF  [Cap,SMD,0402]
C303  100nF  [Cap,SMD,0402]
C304  100nF  [Cap,SMD,0402]
C305  10uF  [Cap,SMD,0402]
C306  100nF  [Cap,SMD,0402]
C307  100nF  [Cap,SMD,0402]
R300  10k  [RES,0402]
R301  10R  [RES,0402]
R302  10R  [RES,0402]
R303  10R  [RES,0402]
R304  10k  [RES,0402]
R305  10k  [RES,0402]
R306  10R  [RES,0402]
R307  10R  [RES,0402]
R308  10R  [RES,0402]
R309  10R  [RES,0402]
R310  10k  [RES,0402]
R311  10k  [RES,0402]
R312  10k  [RES,0402]
U200  TLV9004SIRTER  [IC,QFN-16,3x3]  (parts A,B,E,G,H of 8)
U300  PCM1780DBQR  [IC,TSSOP-16,W3.9,P0.635MM]

### Nets
A_GND: C300.1 C301.1 C302.1 C304.1 C305.2 C307.1 U200.11(V-) U200.17(PAD) U300.12(AGND)
VDD_5VA: C300.2 C301.2 C302.2 U200.2(V+) U300.11(VCC)
LOAD_CELL_BIAS_12: C303.2 R300.1 U200.15(OUT1)
LOAD_CELL_BIAS_34: C306.2 R310.1 U200.5(OUT2)
PCM1780_BCK: R309.1
PCM1780_DATA: R306.1
PCM1780_LRCK: R308.1
PCM1780_MC: R302.1
PCM1780_MD: R303.1
PCM1780_nMS: R301.1
PCM1780_SCK: R307.1
NetC303_1: C303.1 R305.2 U200.16(IN1-)
NetC304_2: C304.2 R300.2 R304.2 R305.1
NetC305_1: C305.1 U200.1(IN1+) U200.3(IN2+) U300.13(VCOM)
NetC306_1: C306.1 R312.2 U200.4(IN2-)
NetC307_2: C307.2 R310.2 R311.2 R312.1
NetR301_2: R301.2 U300.2(~{MS})
NetR302_2: R302.2 U300.3(MC)
NetR303_2: R303.2 U300.4(MD)
NetR304_1: R304.1 U300.15(VOUTL)
NetR306_2: R306.2 U300.6(DATA)
NetR307_2: R307.2 U300.5(SCK)
NetR308_2: R308.2 U300.8(LRCK)
NetR309_2: R309.2 U300.7(BCK)
NetR311_1: R311.1 U300.14(VOUTR)

Not connected (* = marked no-connect by the designer): U200 7(~{SHDN}34)*; U300 1(ZEROL/NA)* 9(NC)* 10(NC)* 16(ZEROR/ZEROA)*

### Notes on the sheet
- Load Cell Biasing
- (near U300) VCOM = VCC / 2
- DETECT pins shorted on other PCB, used for board ID and detecting if inserted correctly.
- Op-amp circuit taken from PCM1780 datasheet page 25.
- Project:
- Title:
- Date:
- Sheet
- of
- Title
- Size:
- A3
- Revision:
- Design By:

### Library data of the parts
C300 C301 C303 C304 C306 C307 = CAP,Cer,100nF,25VDC,X7R,0402: as C502 on sheet Processor; HelpURL: https://search.murata.co.jp/Ceramy/image/img/A01X/G101/ENG/GRM155R71E104KE14-01.pdf; CreatedBy: Judd Foster
C302 C305 = CAP,Cer,10uF,10VDC,X5R,0402: as C506 on sheet Processor; HelpURL: https://media.digikey.com/pdf/Data%20Sheets/Samsung%20PDFs/CL05A106MP5NUNC_Spec.pdf; CreatedBy: Judd Foster
R300 R304 R305 R310-R312 = RES,10k,5%,0.063W,0402: as R500 on sheet Processor; HelpURL: https://www.seielect.com/catalog/sei-rmcf_rmcp.pdf; CreatedBy: Judd Foster
R301-R303 R306-R309 = RES,10R,1%,0.063W,0402: 10 Ohms ±1% 0.063W, 1/16W Chip Resistor 0402 (1005 Metric) Automotive AEC-Q200 Thick Film; Manufacturer: Panasonic Electronic Components; Manufacturer Part Number: ERJ-2RKF10R0X; Vendor Part Number: P10.0LCT-ND; Vendor: Digikey; CreatedBy: Judd Foster; HelpURL: https://industrial.panasonic.com/cdbs/www-data/pdf/RDA0000/AOA0000C304.pdf
U200 = TLV9004SIRTER: General Purpose Amplifier 4 Circuit Rail-to-Rail 16-WQFN (3x3); Manufacturer: Texas Instruments; Vendor Part Number: 296-51829-1-ND; Vendor: Digikey; CreatedBy: Judd Foster; HelpURL: https://www.ti.com/general/docs/suppproductinfo.tsp?distId=10&gotoUrl=https%3A%2F%2Fwww.ti.com%2Flit%2Fgpn%2Ftlv9004; Manufacturer Part Number: TLV9004SIRTER
U300 = PCM1780DBQR: DAC, Audio 24 b 200k I²S 16-SSOP; Manufacturer: Texas Instruments; Vendor Part Number: 296-41373-1-ND; Vendor: Digikey; Manufacturer Part Number: PCM1780DBQR; HelpURL: https://www.ti.com/general/docs/suppproductinfo.tsp?distId=10&gotoUrl=https%3A%2F%2Fwww.ti.com%2Flit%2Fgpn%2Fpcm1780; CreatedBy: Judd Foster

## Sheet Load_Cell_Acquisition.SchDoc
size A3; Organization: Altium Limited; Address1: L3, 12a Rodborough Rd; Address2: Frenchs Forest; Address3: NSW; Address4: Australia 2086; DocumentNumber: 2; SheetNumber: 2; SheetTotal: 8
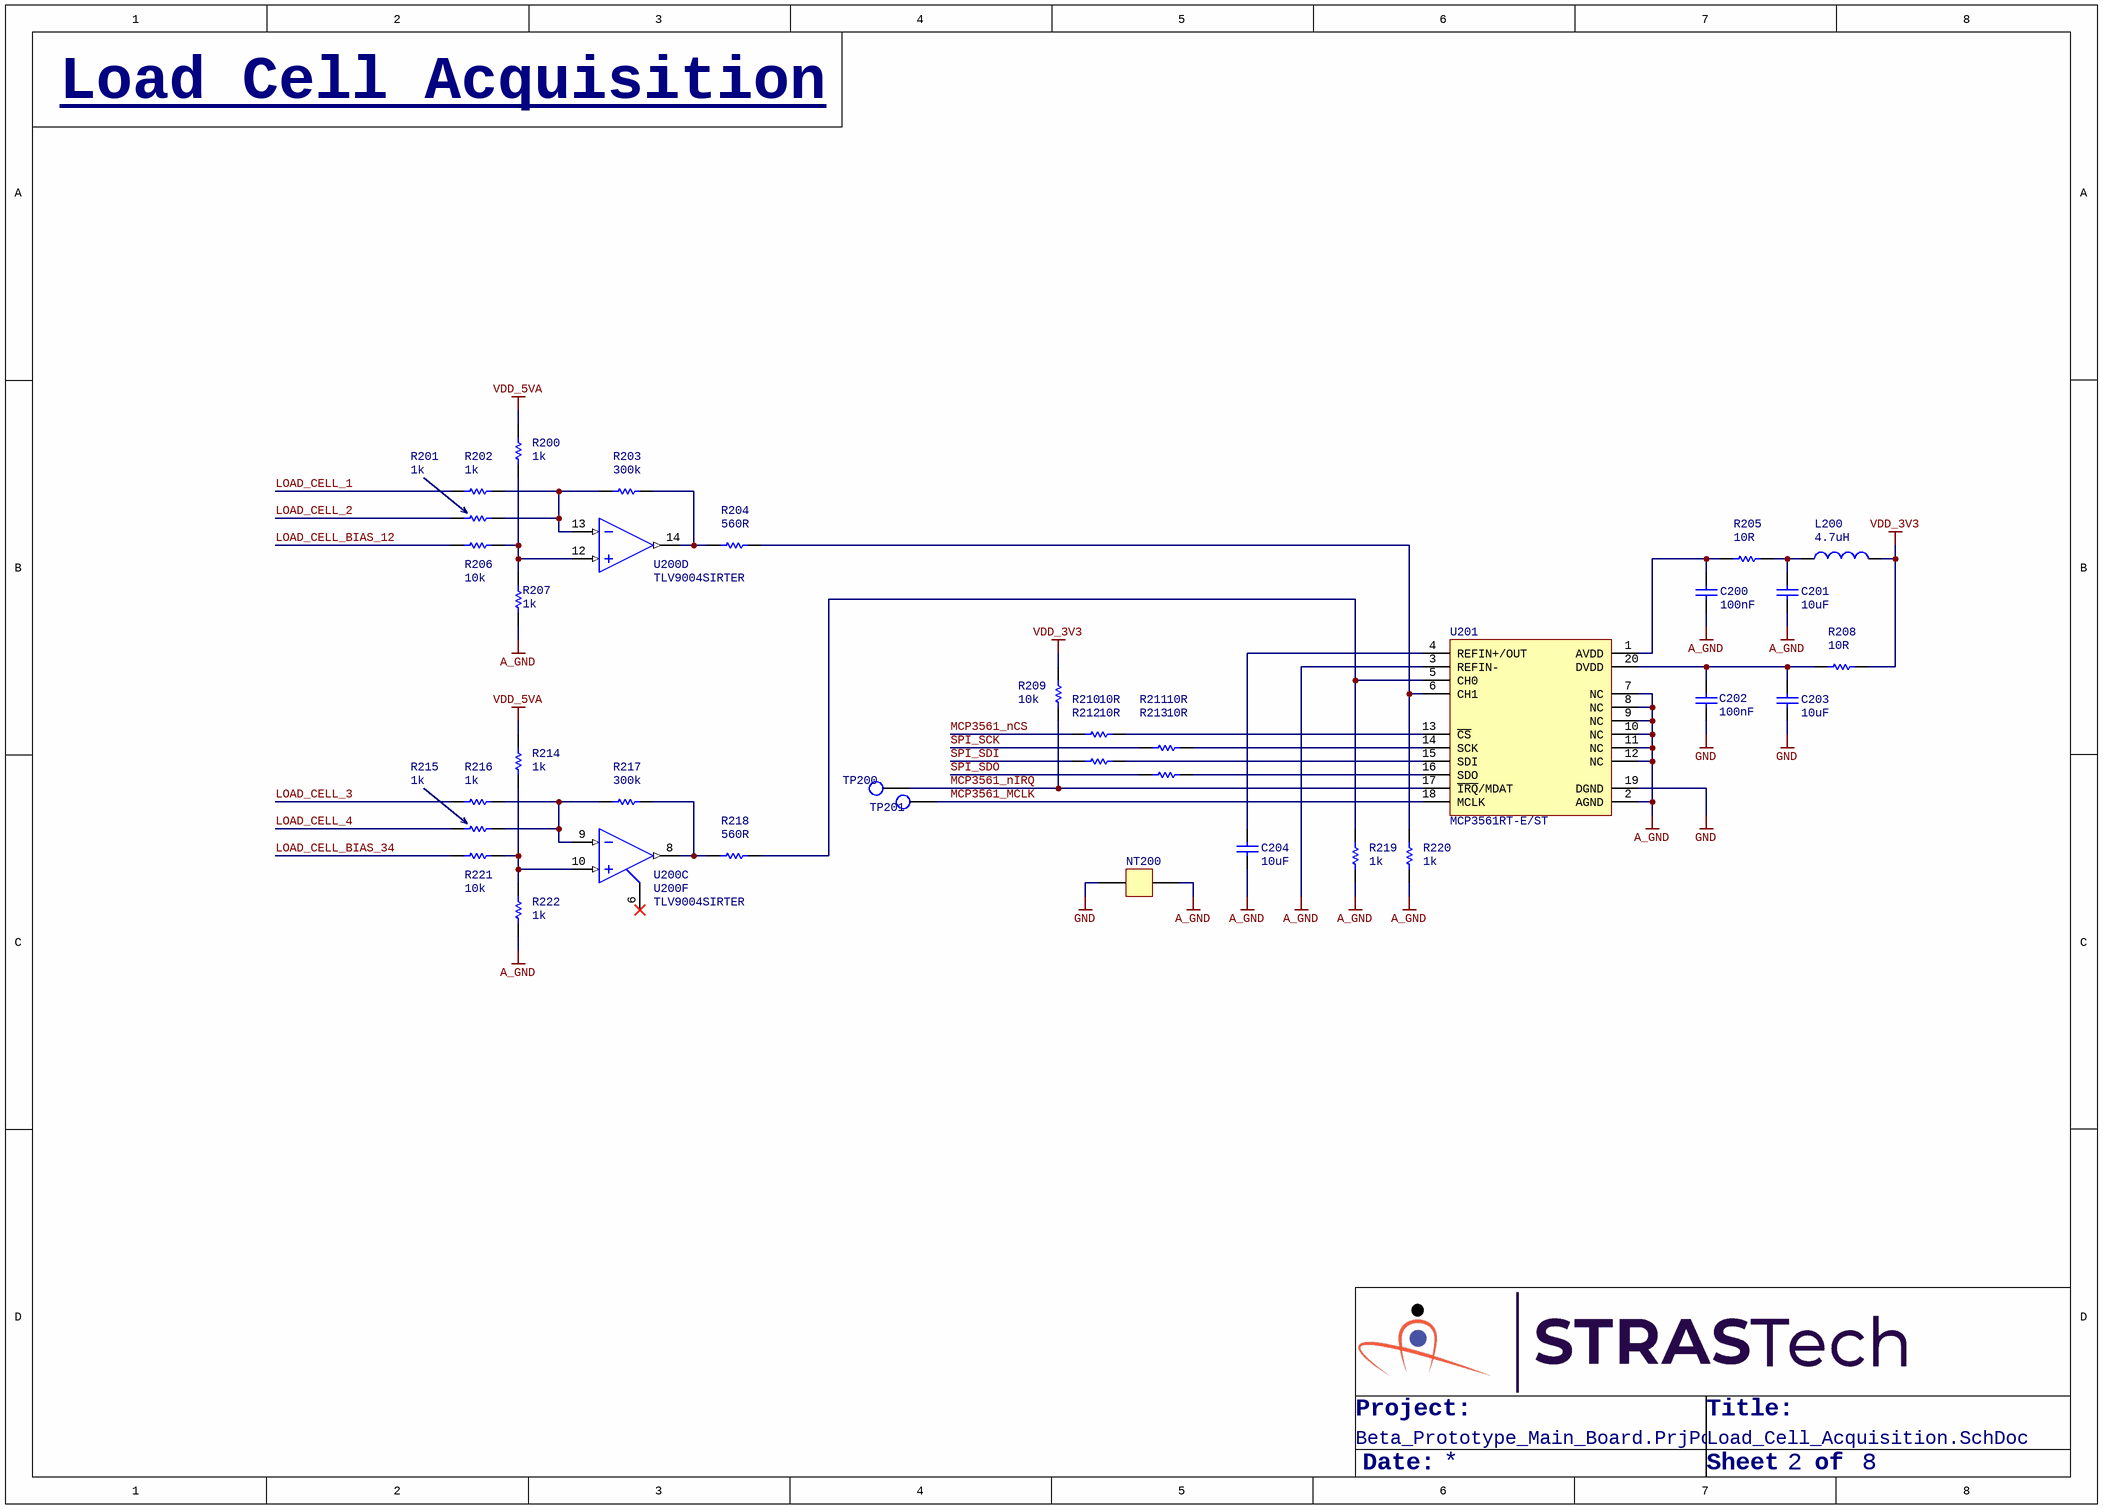
[diagram p3: Load_Cell_Acquisition.SchDoc]

### Parts
C200  100nF  [Cap,SMD,0402]
C201  10uF  [Cap,SMD,0402]
C202  100nF  [Cap,SMD,0402]
C203  10uF  [Cap,SMD,0402]
C204  10uF  [Cap,SMD,0402]
L200  4.7uH  [IND,0805]
NT200  Net Tie  [Net Tie,20x60mil]  (value not drawn)  (net tie, no BOM)
R200  1k  [RES,0402]
R201  1k  [RES,0402]
R202  1k  [RES,0402]
R203  300k  [RES,0402]
R204  560R  [RES,0402]
R205  10R  [RES,0402]
R206  10k  [RES,0402]
R207  1k  [RES,0402]
R208  10R  [RES,0402]
R209  10k  [RES,0402]
R210  10R  [RES,0402]
R211  10R  [RES,0402]
R212  10R  [RES,0402]
R213  10R  [RES,0402]
R214  1k  [RES,0402]
R215  1k  [RES,0402]
R216  1k  [RES,0402]
R217  300k  [RES,0402]
R218  560R  [RES,0402]
R219  1k  [RES,0402]
R220  1k  [RES,0402]
R221  10k  [RES,0402]
R222  1k  [RES,0402]
TP200  TESTPOINT  [testpoint,smd,round,1mm]  (value not drawn)
TP201  TESTPOINT  [testpoint,smd,round,1mm]  (value not drawn)
U200  TLV9004SIRTER  [IC,QFN-16,3x3]  (parts C,D,F of 8)
U201  MCP3561RT-E/ST  [IC,TSSOP-20,W4.4]

### Nets
A_GND: C200.1 C201.2 C204.1 NT200.2 R207.1 R219.2 R220.2 R222.1 U201.2(AGND) U201.3(REFIN-) U201.7(NC) U201.8(NC) U201.9(NC) U201.10(NC) U201.11(NC) U201.12(NC)
GND: C202.1 C203.2 NT200.1 U201.19(DGND)
VDD_3V3: L200.2 R208.2 R209.2
VDD_5VA: R200.2 R214.2
LOAD_CELL_1: R202.2
LOAD_CELL_2: R201.2
LOAD_CELL_3: R216.2
LOAD_CELL_4: R215.2
LOAD_CELL_BIAS_12: R206.1
LOAD_CELL_BIAS_34: R221.1
MCP3561_MCLK: TP201.1(TP) U201.18(MCLK)
MCP3561_nCS: R210.1
MCP3561_nIRQ: R209.1 TP200.1(TP) U201.17(~{IRQ}/MDAT)
SPI_SCK: R211.1
SPI_SDI: R212.1
SPI_SDO: R213.1
NetC200_2: C200.2 R205.1 U201.1(AVDD)
NetC201_1: C201.1 L200.1 R205.2
NetC202_2: C202.2 C203.1 R208.1 U201.20(DVDD)
NetC204_2: C204.2 U201.4(REFIN+/OUT)
NetR200_1: R200.1 R206.2 R207.2 U200.12(IN4+)
NetR201_1: R201.1 R202.1 R203.2 U200.13(IN4-)
NetR203_1: R203.1 R204.2 U200.14(OUT4)
NetR204_1: R204.1 R220.1 U201.6(CH1)
NetR210_2: R210.2 U201.13(~{CS})
NetR211_2: R211.2 U201.14(SCK)
NetR212_2: R212.2 U201.15(SDI)
NetR213_2: R213.2 U201.16(SDO)
NetR214_1: R214.1 R221.2 R222.2 U200.10(IN3+)
NetR215_1: R215.1 R216.1 R217.2 U200.9(IN3-)
NetR217_1: R217.1 R218.2 U200.8(OUT3)
NetR218_1: R218.1 R219.1 U201.5(CH0)

Not connected (* = marked no-connect by the designer): U200 6(~{SHDN}12)*

### Notes on the sheet
- Load Cell Acquisition
- Project:
- Title:
- Date:
- Sheet
- of
- Title
- Size:
- A3
- Revision:
- Design By:

### Library data of the parts
C200 C202 = CAP,Cer,100nF,25VDC,X7R,0402: as C502 on sheet Processor; HelpURL: https://search.murata.co.jp/Ceramy/image/img/A01X/G101/ENG/GRM155R71E104KE14-01.pdf; CreatedBy: Judd Foster
C201 C203 C204 = CAP,Cer,10uF,10VDC,X5R,0402: as C506 on sheet Processor; HelpURL: https://media.digikey.com/pdf/Data%20Sheets/Samsung%20PDFs/CL05A106MP5NUNC_Spec.pdf; CreatedBy: Judd Foster
L200 = IND,4.7uH,80mA,Multilayer,0805: 4.7 µH Shielded Multilayer Inductor 80 mA 300mOhm 0805 (2012 Metric); Vendor Part Number: 445-3169-1-ND; Manufacturer: TDK Corporation; Manufacturer Part Number: MLZ2012E4R7MT000; Vendor: Digikey; HelpURL: https://product.tdk.com/en/system/files?file=dam/doc/product/inductor/inductor/smd/catalog/inductor_commercial_decoupling_mlz2012_en.pdf; CreatedBy: Judd Foster
R200-R202 R207 R214-R216 R219 R220 R222 = RES,1k,5%,0.063W,0402: as R803 on sheet USB_Serial; HelpURL: https://www.seielect.com/catalog/sei-rmcf_rmcp.pdf; CreatedBy: Judd Foster
R203 R217 = RES,300k,1%,0.063W,0402: 300 kOhms ±1% 0.063W, 1/16W Chip Resistor 0402 (1005 Metric) Automotive AEC-Q200 Thick Film; Manufacturer: Stackpole Electronics Inc; Manufacturer Part Number: RMCF0402FT300K; Vendor Part Number: RMCF0402FT300KCT-ND; Vendor: Digikey; CreatedBy: Judd Foster; HelpURL: https://www.seielect.com/catalog/sei-rmcf_rmcp.pdf
R204 R218 = RES,560R,1%,0.063W,0402: 560 Ohms ±1% 0.063W, 1/16W Chip Resistor 0402 (1005 Metric) Automotive AEC-Q200, Moisture Resistant Thick Film; Manufacturer: TE Connectivity Passive Product; Manufacturer Part Number: CRGCQ0402F560R; Vendor Part Number: A129624CT-ND; Vendor: Digikey; CreatedBy: Judd Foster; HelpURL: https://www.te.com/commerce/DocumentDelivery/DDEController?Action=srchrtrv&DocNm=1773204-3&DocType=DS&DocLang=English
R205 R208 R210-R213 = RES,10R,1%,0.063W,0402: as R301 on sheet Load_Cell_Biasing; CreatedBy: Judd Foster; HelpURL: https://industrial.panasonic.com/cdbs/www-data/pdf/RDA0000/AOA0000C304.pdf
R206 R209 R221 = RES,10k,5%,0.063W,0402: as R500 on sheet Processor; HelpURL: https://www.seielect.com/catalog/sei-rmcf_rmcp.pdf; CreatedBy: Judd Foster
TP200 TP201 = TESTPOINT: PCB Testpoint; CreatedBy: Judd Foster; HelpURL: N/A; Manufacturer: N/A; Manufacturer Part Number: N/A; Vendor: N/A; Vendor Part Number: N/A
U200 = TLV9004SIRTER: as U200 on sheet Load_Cell_Biasing; CreatedBy: Judd Foster; HelpURL: https://www.ti.com/general/docs/suppproductinfo.tsp?distId=10&gotoUrl=https%3A%2F%2Fwww.ti.com%2Flit%2Fgpn%2Ftlv9004; Manufacturer Part Number: TLV9004SIRTER
U201 = MCP3561RT-E/ST: 24 Bit Analog to Digital Converter 1 Input 1 Sigma-Delta 20-TSSOP; Vendor Part Number: 150-MCP3561RT-E/STCT-ND; Manufacturer: Microchip Technology; Vendor: Digikey; Manufacturer Part Number: MCP3561RT-E/ST; HelpURL: https://ww1.microchip.com/downloads/en/DeviceDoc/MCP3561.2.4R-Data-Sheet-DS200006391A.pdf; CreatedBy: Judd Foster
NT200 = Net Tie: CreatedBy: Makan Mousavi; HelpURL: N/A; Manufacturer: N/A; Manufacturer Part Number: N/A; Vendor: N/A; Vendor Part Number: N/A

## Sheet Inertial_Measurement_RTC.SchDoc
size A3; Organization: Altium Limited; Address1: L3, 12a Rodborough Rd; Address2: Frenchs Forest; Address3: NSW; Address4: Australia 2086; DocumentNumber: 1; SheetNumber: 1; SheetTotal: 8
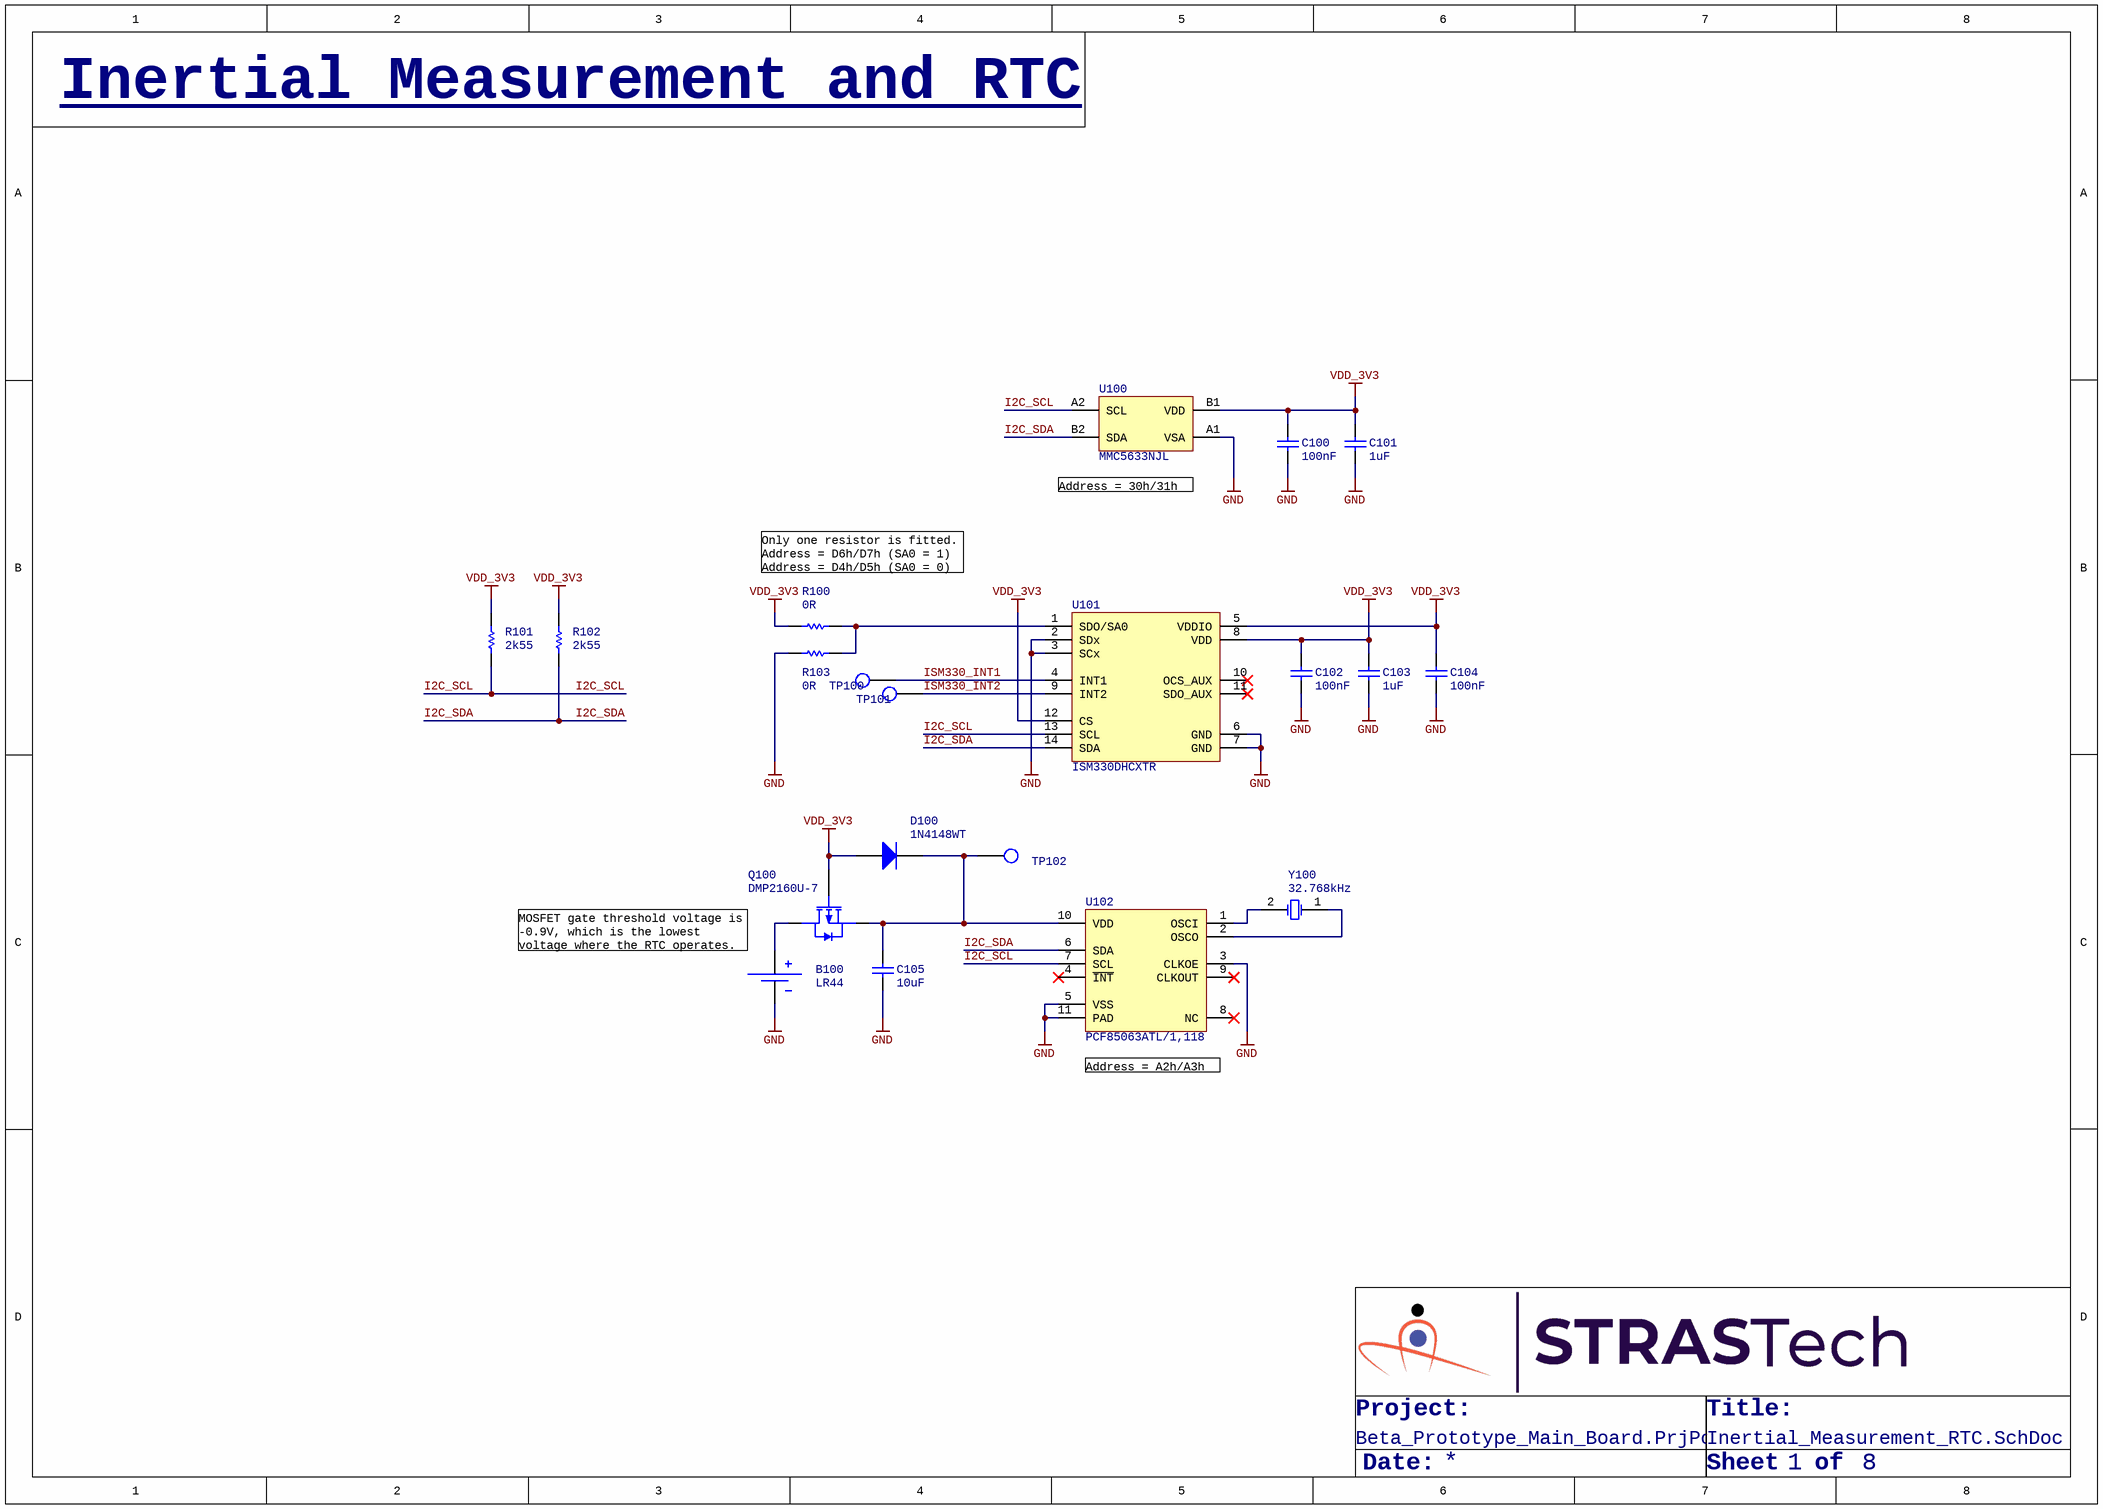
[diagram p4: Inertial_Measurement_RTC.SchDoc]

### Parts
B100  LR44  [Holder,Cell,LR44,PCB,Thru]
C100  100nF  [Cap,SMD,0402]
C101  1uF  [Cap,SMD,0402]
C102  100nF  [Cap,SMD,0402]
C103  1uF  [Cap,SMD,0402]
C104  100nF  [Cap,SMD,0402]
C105  10uF  [Cap,SMD,0402]
D100  1N4148WT  [SOD523]
Q100  DMP2160U-7  [SOT23-3]
R100  0R  [RES,0402]
R101  2k55  [RES,0402]
R102  2k55  [RES,0402]
R103  0R  [RES,0402]
TP100  TESTPOINT  [testpoint,smd,round,1mm]  (value not drawn)
TP101  TESTPOINT  [testpoint,smd,round,1mm]  (value not drawn)
TP102  TESTPOINT  [testpoint,smd,round,1mm]  (value not drawn)
U100  MMC5633NJL  [IC,WLP,2x2,P0.4mm]
U101  ISM330DHCXTR  [IC,LGA-14L,2.5x3mm]
U102  PCF85063ATL/1,118  [IC,DFN-10_3x3,P0.5mm]
Y100  32.768kHz  [XTAL,SMD,2PIN,2.0x1.2MM]

### Nets
GND: B100.2(BATT_N) C100.2 C101.1 C102.1 C103.1 C104.1 C105.2 R103.1 U100.A1(VSA) U101.2(SDx) U101.3(SCx) U101.6(GND) U101.7(GND) U102.3(CLKOE) U102.5(VSS) U102.11(PAD)
VDD_3V3: C100.1 C101.2 C102.2 C103.2 C104.2 D100.2(A) Q100.1(G) R100.1 R101.2 R102.2 U100.B1(VDD) U101.5(VDDIO) U101.8(VDD) U101.12(CS)
I2C_SCL: R101.1 U100.A2(SCL) U101.13(SCL) U102.7(SCL)
I2C_SDA: R102.1 U100.B2(SDA) U101.14(SDA) U102.6(SDA)
ISM330_INT1: TP100.1(TP) U101.4(INT1)
ISM330_INT2: TP101.1(TP) U101.9(INT2)
NetB100_1: B100.1(BATT_P) Q100.3(D)
NetC105_1: C105.1 D100.1(K) Q100.2(S) TP102.1(TP) U102.10(VDD)
NetR100_2: R100.2 R103.2 U101.1(SDO/SA0)
NetU102_1: U102.1(OSCI) Y100.2(GND)
NetU102_2: U102.2(OSCO) Y100.1(OSC1)

Not connected (* = marked no-connect by the designer): U101 10(OCS_AUX)* 11(SDO_AUX)*; U102 4(~{INT})* 8(NC)* 9(CLKOUT)*

### Notes on the sheet
- Inertial Measurement and RTC
- (near U100) Address = 30h/31h
- Only one resistor is fitted.
  Address = D6h/D7h (SA0 = 1)
  Address = D4h/D5h (SA0 = 0)
- MOSFET gate threshold voltage is -0.9V, which is the lowest voltage where the RTC operates.
- (near U102) Address = A2h/A3h
- Project:
- Title:
- Date:
- Sheet
- of
- Title
- Size:
- A3
- Revision:
- Design By:

### Library data of the parts
B100 = Holder,Cell,LR44,PCB,Thru: Battery Retainer Coin, 11.6mm 1 Cell PC Pin; Manufacturer: Keystone Electronics; Manufacturer Part Number: 2997; Vendor Part Number: 36-2997-ND; Vendor: Digikey; CreatedBy: Judd Foster; HelpURL: https://www.keyelco.com/userAssets/file/M65p7.pdf
C100 C102 C104 = CAP,Cer,100nF,25VDC,X7R,0402: as C502 on sheet Processor; HelpURL: https://search.murata.co.jp/Ceramy/image/img/A01X/G101/ENG/GRM155R71E104KE14-01.pdf; CreatedBy: Judd Foster
C101 C103 = CAP,Cer,1uF,35VDC,X5R,0402: as C504 on sheet Processor; HelpURL: https://product.tdk.com/info/en/catalog/datasheets/mlcc_commercial_general_en.pdf?ref_disty=digikey; CreatedBy: Judd Foster
C105 = CAP,Cer,10uF,10VDC,X5R,0402: as C506 on sheet Processor; HelpURL: https://media.digikey.com/pdf/Data%20Sheets/Samsung%20PDFs/CL05A106MP5NUNC_Spec.pdf; CreatedBy: Judd Foster
D100 = DIODE,Gen,75V,200mA,SOD523F: Diode Standard 75 V 200mA Surface Mount SOD-523F; Manufacturer: ON Semiconductor; Vendor Part Number: 1N4148WTCT-ND; Vendor: Digikey; CreatedBy: Judd Foster; HelpURL: https://rocelec.widen.net/view/pdf/bnxdzepaue/ONSM-S-A0003584797-1.pdf?t.download=true&u=5oefqw; Manufacturer Part Number: 1N4148WT
Q100 = MOSFET,P Ch,20V,3.2A: P-Channel 20 V 3.2A (Ta) 1.4W (Ta) Surface Mount SOT-23-3; Manufacturer: Diodes Incorporated; Vendor Part Number: DMP2160UDICT-ND; Vendor: Digikey; CreatedBy: Judd Foster; HelpURL: https://media.digikey.com/pdf/Data%20Sheets/Diodes%20PDFs/DMP2160U.pdf; Manufacturer Part Number: DMP2160U-7
R100 R103 = RES,0R0,0.1W,0402: as R804 on sheet USB_Serial; CreatedBy: Judd Foster; HelpURL: https://industrial.panasonic.com/cdbs/www-data/pdf/RDA0000/AOA0000C301.pdf
R101 R102 = RES,2k55,1%,0.063W,0402: 2.55 kOhms ±1% 0.063W, 1/16W Chip Resistor 0402 (1005 Metric) Automotive AEC-Q200 Thick Film; Manufacturer: Stackpole Electronics Inc; Manufacturer Part Number: RMCF0402FT2K55; Vendor Part Number: RMCF0402FT2K55CT-ND; Vendor: Digikey; CreatedBy: Judd Foster; HelpURL: https://www.seielect.com/catalog/sei-rmcf_rmcp.pdf
TP100-TP102 = TESTPOINT: PCB Testpoint; CreatedBy: Judd Foster; HelpURL: N/A; Manufacturer: N/A; Manufacturer Part Number: N/A; Vendor: N/A; Vendor Part Number: N/A
U100 = MMC5633NJL: Magnetoresistive Sensor X, Y, Z Axis 4-WLP (0.85x0.85); Manufacturer: Memsic Inc.; Vendor Part Number: 1267-MMC5633NJLCT-ND; Vendor: Digikey; CreatedBy: Judd Foster; HelpURL: https://media.digikey.com/pdf/Data%20Sheets/MEMSIC%20PDFs/MMC5633NJL_RevA_3-12-20.pdf; Manufacturer Part Number: MMC5633NJL
U101 = ISM330DHCXTR: Accelerometer, Gyroscope, Temperature, 6 Axis Sensor I²C, SPI Output; Manufacturer: STMicroelectronics; Vendor Part Number: 497-19784-1-ND; Vendor: Digikey; CreatedBy: Judd Foster; HelpURL: https://www.st.com/resource/en/datasheet/ism330dhcx.pdf; Manufacturer Part Number: ISM330DHCXTR
U102 = PCF85063ATL/1,118: Real Time Clock (RTC) IC Clock/Calendar - I²C, 2-Wire Serial 10-XFDFN Exposed Pad; Manufacturer: NXP USA Inc.; Vendor Part Number: 568-10235-1-ND; Vendor: Digikey; CreatedBy: Judd Foster; HelpURL: https://www.nxp.com/docs/en/data-sheet/PCF85063A.pdf; Manufacturer Part Number: PCF85063ATL/1,118
Y100 = XTAL,32.768kHz,9pF,SMD: 32.768 kHz ±20ppm Crystal 9pF 70 kOhms 2-SMD, No Lead; Manufacturer: Micro Crystal AG; Manufacturer Part Number: CM8V-T1A-32.768KHZ-9PF-20PPM-TA-QC; Vendor Part Number: 2195-CM8V-T1A-32.768KHZ-9PF-20PPM-TA-QCCT-ND; Vendor: Digikey; CreatedBy: Judd Foster; HelpURL: https://www.microcrystal.com/fileadmin/Media/Products/32kHz/Datasheet/CM8V-T1A.pdf

## Sheet Peripherals_Main_Board.SchDoc
size A3; Organization: Altium Limited; Address1: L3, 12a Rodborough Rd; Address2: Frenchs Forest; Address3: NSW; Address4: Australia 2086; DocumentNumber: 4; SheetNumber: 4; SheetTotal: 8
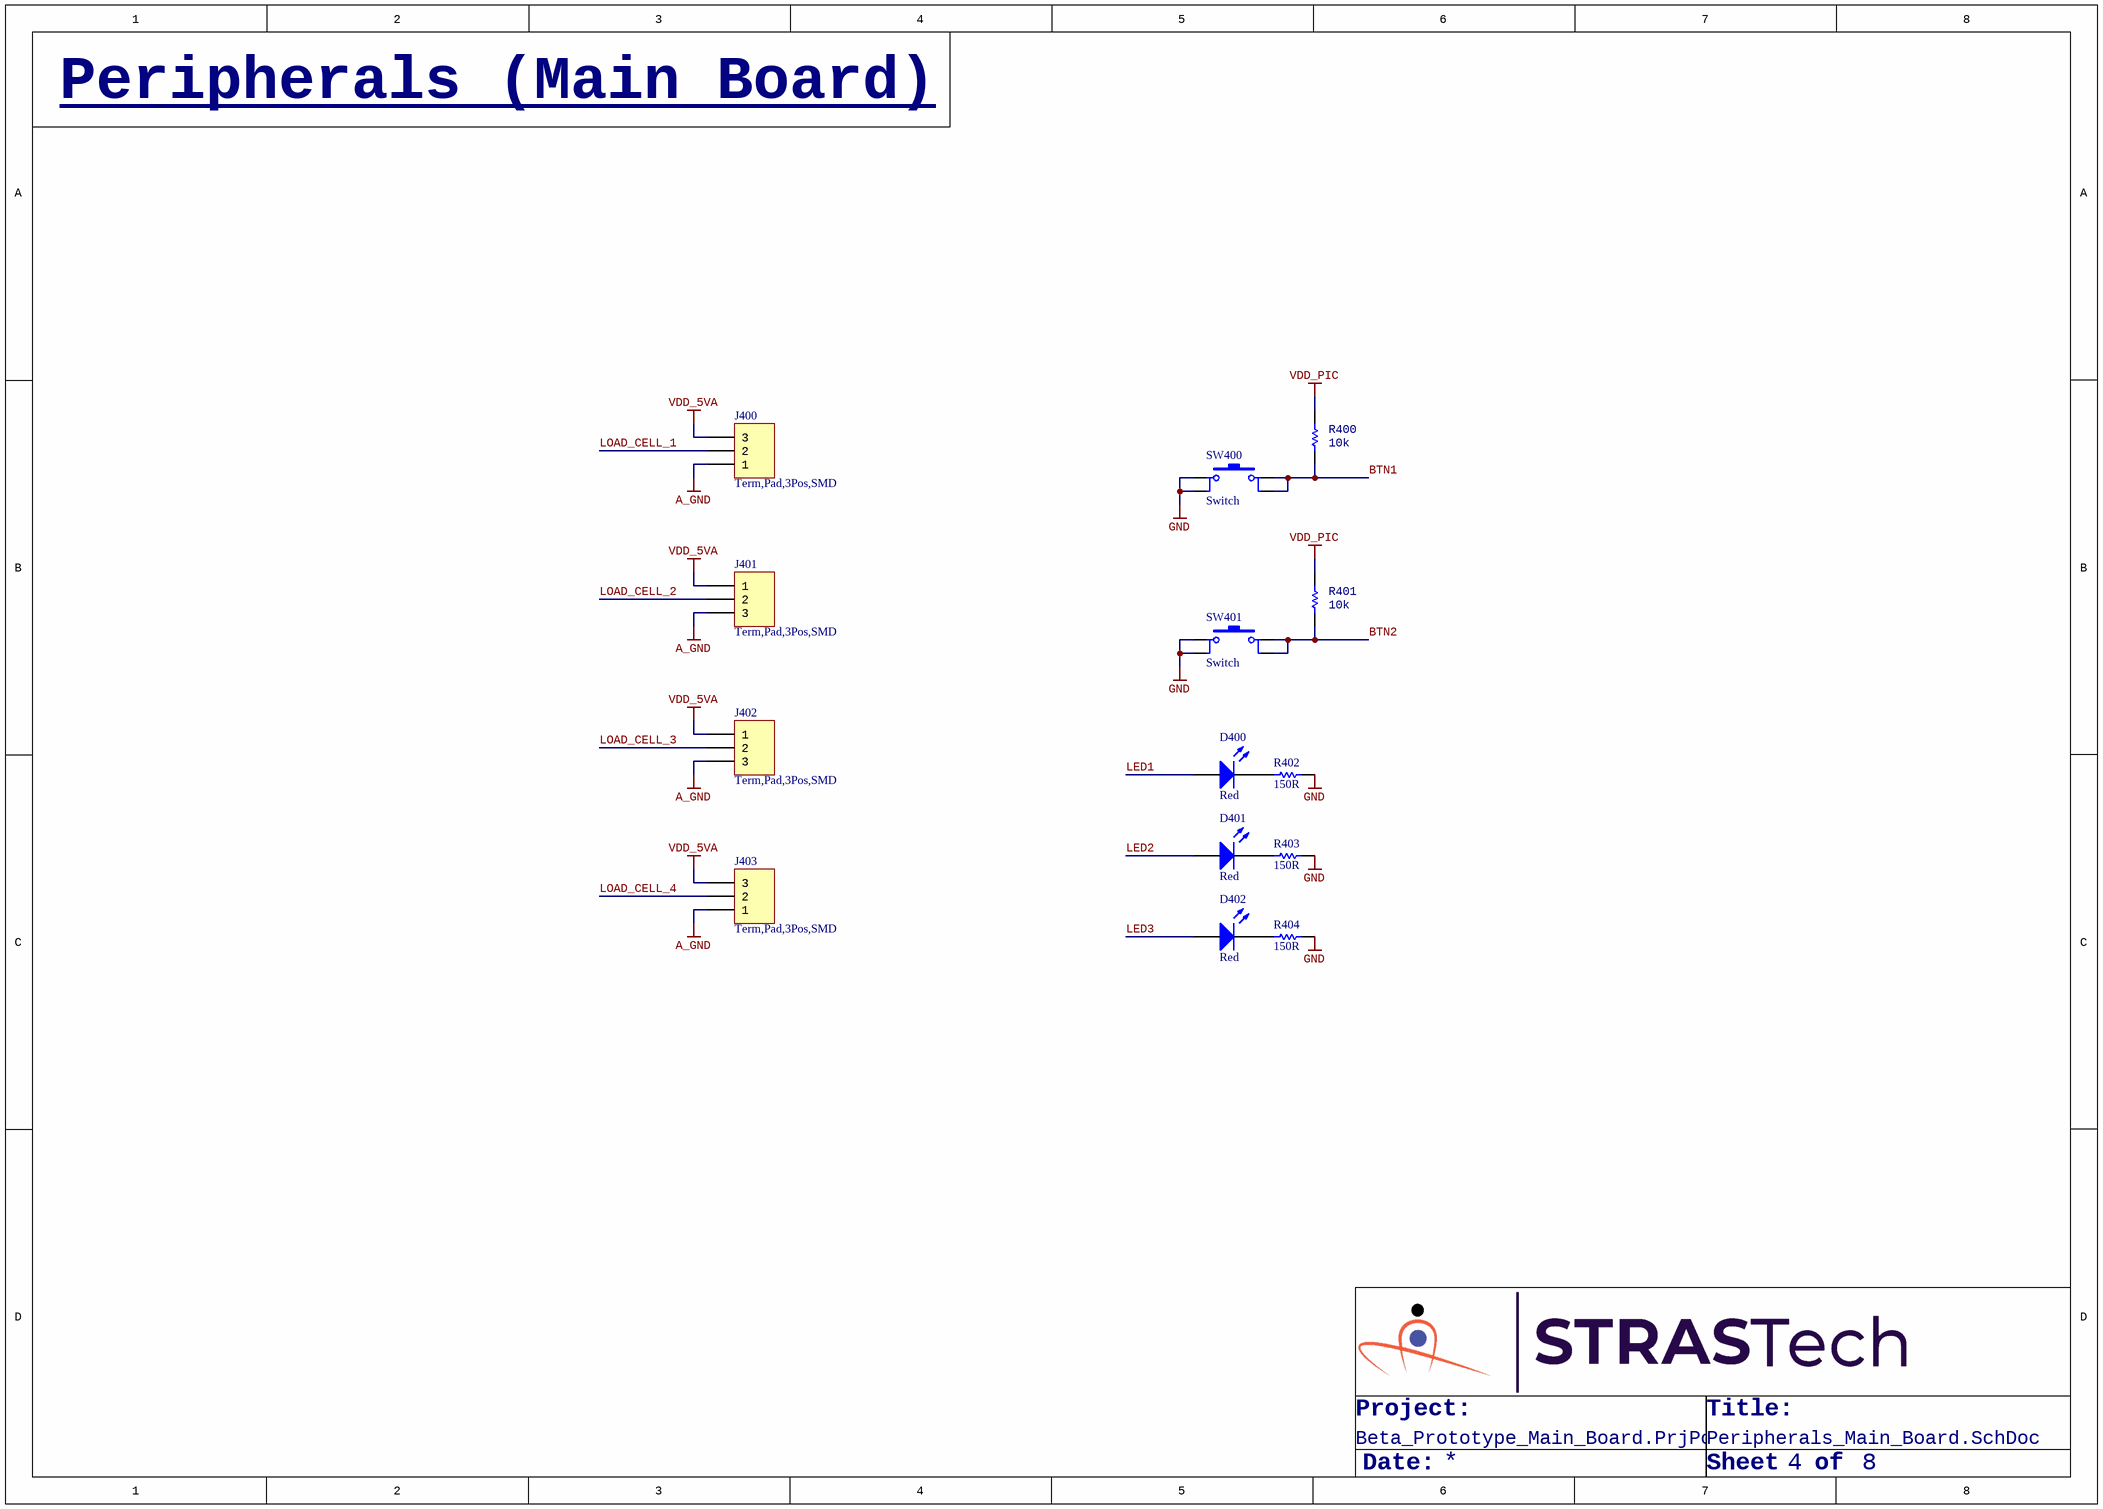
[diagram p5: Peripherals_Main_Board.SchDoc]

### Parts
D400  Red  [LED,5mm,Thru]
D401  Red  [LED,5mm,Thru]
D402  Red  [LED,5mm,Thru]
J400  Term,Pad,3Pos,SMD  [Term,Pad,3Pos,SMD]
J401  Term,Pad,3Pos,SMD  [Term,Pad,3Pos,SMD]
J402  Term,Pad,3Pos,SMD  [Term,Pad,3Pos,SMD]
J403  Term,Pad,3Pos,SMD  [Term,Pad,3Pos,SMD]
R400  10k  [RES,0402]
R401  10k  [RES,0402]
R402  150R  [RES,0402]
R403  150R  [RES,0402]
R404  150R  [RES,0402]
SW400  Switch  [Switch,Tactile,SPST-NO,SMD]
SW401  Switch  [Switch,Tactile,SPST-NO,SMD]

### Nets
A_GND: J400.1 J401.3 J402.3 J403.1
GND: R402.2 R403.2 R404.2 SW400.1 SW400.2 SW401.1 SW401.2
VDD_5VA: J400.3 J401.1 J402.1 J403.3
VDD_PIC: R400.1 R401.1
BTN1: R400.2 SW400.3 SW400.4
BTN2: R401.2 SW401.3 SW401.4
LED1: D400.1(A)
LED2: D401.1(A)
LED3: D402.1(A)
LOAD_CELL_1: J400.2
LOAD_CELL_2: J401.2
LOAD_CELL_3: J402.2
LOAD_CELL_4: J403.2
NetD400_2: D400.2(K) R402.1
NetD401_2: D401.2(K) R403.1
NetD402_2: D402.2(K) R404.1

### Notes on the sheet
- Peripherals (Main Board)
- Project:
- Title:
- Date:
- Sheet
- of
- Title
- Size:
- A3
- Revision:
- Design By:

### Library data of the parts
D400-D402 = LED,Red,5mm,Thru: Red 623nm LED Indication - Discrete 2V Radial; Manufacturer: TT Electronics/Optek Technology; Manufacturer Part Number: OVLFR3C7; Vendor Part Number: 365-1182-ND; Vendor: Digikey; CreatedBy: Judd Foster; HelpURL: https://www.ttelectronics.com/TTElectronics/media/ProductFiles/Datasheets/OVLFx3C7.pdf
J400-J403 = Term,Pad,3Pos,SMD: SMD pads for soldering wires with strain relief; Vendor: N/A; Vendor Part Number: N/A; HelpURL: N/A; Manufacturer: N/A; Manufacturer Part Number: N/A; Created By: Judd Foster
R400 R401 = RES,10k,5%,0.063W,0402: as R500 on sheet Processor; HelpURL: https://www.seielect.com/catalog/sei-rmcf_rmcp.pdf; CreatedBy: Judd Foster
R402-R404 = RES,150R,1%,0.1W,0402: as R504 on sheet Processor; CreatedBy: Judd Foster; HelpURL: https://www.te.com/commerce/DocumentDelivery/DDEController?Action=srchrtrv&DocNm=1773204-3&DocType=DS&DocLang=English
SW400 SW401 = Switch,Tactile,SPST-NO,SMD,H5.0: Tactile Switch SPST-NO Top Actuated Surface Mount; Manufacturer: C&K; Manufacturer Part Number: PTS645SK50SMTR92 LFS; Vendor Part Number: CKN9087CT-ND; Vendor: Digikey; CreatedBy: Judd Foster; HelpURL: https://dznh3ojzb2azq.cloudfront.net/products/Tactile/PTS645/documents/datasheet.pdf

## Sheet Regulation_Charging.SchDoc
size A3; Organization: Altium Limited; Address1: L3, 12a Rodborough Rd; Address2: Frenchs Forest; Address3: NSW; Address4: Australia 2086; DocumentNumber: 6; SheetNumber: 6; SheetTotal: 8
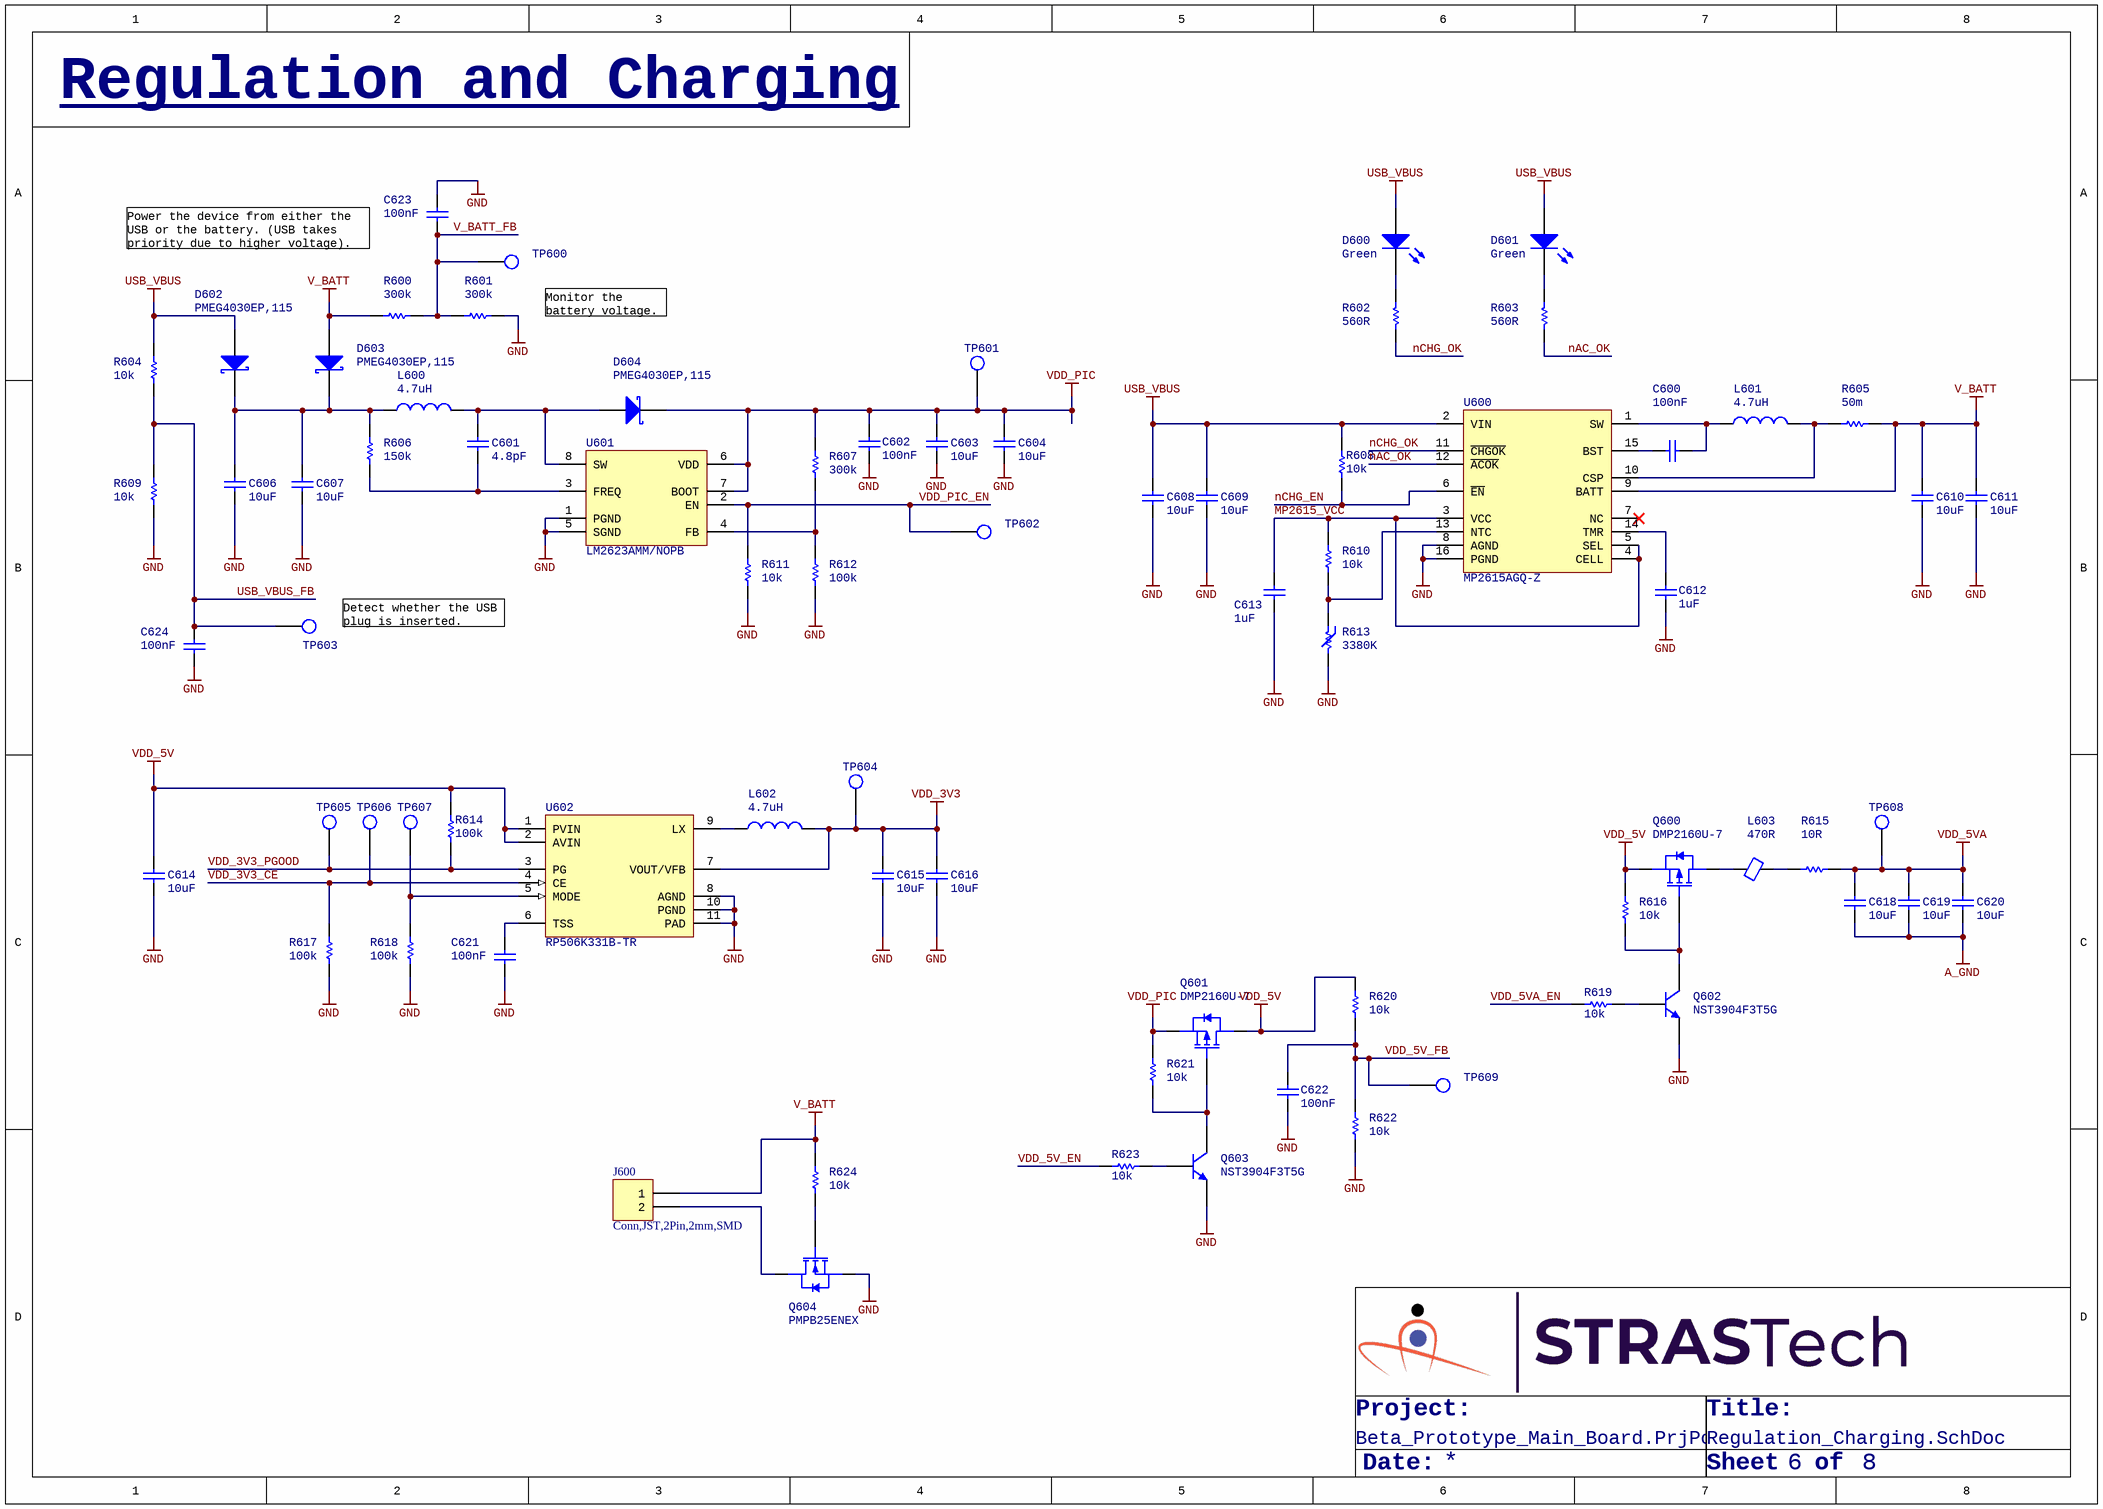
[diagram p6: Regulation_Charging.SchDoc]

### Parts
C600  100nF  [Cap,SMD,0402]
C601  4.8pF  [Cap,SMD,0402]
C602  100nF  [Cap,SMD,0402]
C603  10uF  [Cap,SMD,0402]
C604  10uF  [Cap,SMD,0402]
C606  10uF  [Cap,SMD,0402]
C607  10uF  [Cap,SMD,0402]
C608  10uF  [Cap,SMD,0402]
C609  10uF  [Cap,SMD,0402]
C610  10uF  [Cap,SMD,0402]
C611  10uF  [Cap,SMD,0402]
C612  1uF  [Cap,SMD,0402]
C613  1uF  [Cap,SMD,0402]
C614  10uF  [Cap,SMD,0402]
C615  10uF  [Cap,SMD,0402]
C616  10uF  [Cap,SMD,0402]
C618  10uF  [Cap,SMD,0402]
C619  10uF  [Cap,SMD,0402]
C620  10uF  [Cap,SMD,0402]
C621  100nF  [Cap,SMD,0402]
C622  100nF  [Cap,SMD,0402]
C623  100nF  [Cap,SMD,0402]
C624  100nF  [Cap,SMD,0402]
D600  Green  [LED,0603]
D601  Green  [LED,0603]
D602  PMEG4030EP,115  [SOD128]
D603  PMEG4030EP,115  [SOD128]
D604  PMEG4030EP,115  [SOD128]
J600  Conn,JST,2Pin,2mm,SMD  [Conn,JST,2Pin,2mm,SMD]
L600  4.7uH  [IND,WIREWOUND,4.9x4.9,SMD]
L601  4.7uH  [IND,WIREWOUND,4.9x4.9,SMD]
L602  4.7uH  [IND,WIREWOUND,4.9x4.9,SMD]
L603  470R  [IND,0402]
Q600  DMP2160U-7  [SOT23-3]
Q601  DMP2160U-7  [SOT23-3]
Q602  NST3904F3T5G  [SOT1123]
Q603  NST3904F3T5G  [SOT1123]
Q604  PMPB25ENEX  [IC,WDFN-6,P0.65]
R600  300k  [RES,0402]
R601  300k  [RES,0402]
R602  560R  [RES,0402]
R603  560R  [RES,0402]
R604  10k  [RES,0402]
R605  50m  [RES,1206]
R606  150k  [RES,0402]
R607  300k  [RES,0402]
R608  10k  [RES,0402]
R609  10k  [RES,0402]
R610  10k  [RES,0402]
R611  10k  [RES,0402]
R612  100k  [RES,0402]
R613  3380K  [RES,0402]
R614  100k  [RES,0402]
R615  10R  [RES,0402]
R616  10k  [RES,0402]
R617  100k  [RES,0402]
R618  100k  [RES,0402]
R619  10k  [RES,0402]
R620  10k  [RES,0402]
R621  10k  [RES,0402]
R622  10k  [RES,0402]
R623  10k  [RES,0402]
R624  10k  [RES,0402]
TP600  TESTPOINT  [testpoint,smd,round,1mm]  (value not drawn)
TP601  TESTPOINT  [testpoint,smd,round,1mm]  (value not drawn)
TP602  TESTPOINT  [testpoint,smd,round,1mm]  (value not drawn)
TP603  TESTPOINT  [testpoint,smd,round,1mm]  (value not drawn)
TP604  TESTPOINT  [testpoint,smd,round,1mm]  (value not drawn)
TP605  TESTPOINT  [testpoint,smd,round,1mm]  (value not drawn)
TP606  TESTPOINT  [testpoint,smd,round,1mm]  (value not drawn)
TP607  TESTPOINT  [testpoint,smd,round,1mm]  (value not drawn)
TP608  TESTPOINT  [testpoint,smd,round,1mm]  (value not drawn)
TP609  TESTPOINT  [testpoint,smd,round,1mm]  (value not drawn)
U600  MP2615AGQ-Z  [IC,QFN-16,3x3,P5x3]
U601  LM2623AMM/NOPB  [IC,TSSOP-8,W3.0]
U602  RP506K331B-TR  [IC,DFN-10_3x3,P0.5mm]

### Nets
A_GND: C618.1 C619.1 C620.1
GND: C602.2 C603.1 C604.1 C606.1 C607.1 C608.1 C609.1 C610.1 C611.1 C612.2 C613.1 C614.1 C615.1 C616.1 C621.1 C622.2 C623.2 C624.1 Q602.2(E) Q603.2(E) Q604.3(S) R601.1 R609.1 R611.1 R612.1 R613.2 R617.1 R618.2 R622.1 U600.8(AGND) U600.16(PGND) U601.1(PGND) U601.5(SGND) U602.8(AGND) U602.10(PGND) U602.11(PAD)
USB_VBUS: C608.2 C609.2 D600.1(A) D601.1(A) D602.2(A) R604.2 R608.1 U600.2(VIN)
V_BATT: C610.2 C611.2 D603.2(A) J600.1 R600.2 R605.2 R624.2 U600.9(BATT)
VDD_3V3: C615.2 C616.2 L602.2 TP604.1(TP) U602.7(VOUT/VFB)
VDD_5V: C614.2 Q600.2(S) Q601.3(D) R614.2 R616.2 R620.2 U602.1(PVIN) U602.2(AVIN)
VDD_5VA: C618.2 C619.2 C620.2 R615.2 TP608.1(TP)
VDD_PIC: C602.1 C603.2 C604.2 D604.1(K) Q601.2(S) R607.2 R621.2 TP601.1(TP) U601.6(VDD) U601.7(BOOT)
MP2615_VCC: C613.2 R610.1 U600.3(VCC) U600.4(CELL) U600.5(SEL)
nAC_OK: R603.2 U600.12(~{ACOK})
nCHG_EN: R608.2 U600.6(~{EN})
nCHG_OK: R602.2 U600.11(~{CHGOK})
USB_VBUS_FB: C624.2 R604.1 R609.2 TP603.1(TP)
V_BATT_FB: C623.1 R600.1 R601.2 TP600.1(TP)
VDD_3V3_CE: R617.2 TP606.1(TP) U602.4(CE)
VDD_3V3_PGOOD: R614.1 TP605.1(TP) U602.3(PG)
VDD_5V_EN: R623.2
VDD_5V_FB: C622.1 R620.1 R622.2 TP609.1(TP)
VDD_5VA_EN: R619.2
VDD_PIC_EN: R611.2 TP602.1(TP) U601.2(EN)
NetC600_1: C600.1 L601.1 U600.1(SW)
NetC600_2: C600.2 U600.15(BST)
NetC601_1: C601.1 R606.1 U601.3(FREQ)
NetC601_2: C601.2 D604.2(A) L600.2 U601.8(SW)
NetC606_2: C606.2 C607.2 D602.1(K) D603.1(K) L600.1 R606.2
NetC612_1: C612.1 U600.14(TMR)
NetC621_2: C621.2 U602.6(TSS)
NetD600_2: D600.2(K) R602.1
NetD601_2: D601.2(K) R603.1
NetJ600_2: J600.2 Q604.1(D)
NetL601_2: L601.2 R605.1 U600.10(CSP)
NetL602_1: L602.1 U602.9(LX)
NetL603_1: L603.1 Q600.3(D)
NetL603_2: L603.2 R615.1
NetQ600_1: Q600.1(G) Q602.3(C) R616.1
NetQ601_1: Q601.1(G) Q603.3(C) R621.1
NetQ602_1: Q602.1(B) R619.1
NetQ603_1: Q603.1(B) R623.1
NetQ604_2: Q604.2(G) R624.1
NetR607_1: R607.1 R612.2 U601.4(FB)
NetR610_2: R610.2 R613.1 U600.13(NTC)
NetR618_1: R618.1 TP607.1(TP) U602.5(MODE)

Not connected (* = marked no-connect by the designer): U600 7(NC)*

### Notes on the sheet
- Regulation and Charging
- Power the device from either the USB or the battery. (USB takes priority due to higher voltage).
- Monitor the battery voltage.
- (near TP603) Detect whether the USB plug is inserted.
- Project:
- Title:
- Date:
- Sheet
- of
- Title
- Size:
- A3
- Revision:
- Design By:

### Library data of the parts
C600 C602 C621-C624 = CAP,Cer,100nF,25VDC,X7R,0402: as C502 on sheet Processor; HelpURL: https://search.murata.co.jp/Ceramy/image/img/A01X/G101/ENG/GRM155R71E104KE14-01.pdf; CreatedBy: Judd Foster
C601 = CAP,Cer,4.8pF,50VDC,C0G/NP0,0402: as C500 on sheet Processor; HelpURL: https://search.murata.co.jp/Ceramy/image/img/A01X/G101/ENG/GCQ1555C1H4R8CB01-01.pdf; CreatedBy: Judd Foster
C603 C604 C606-C611 C614-C616 C618-C620 = CAP,Cer,10uF,10VDC,X5R,0402: as C506 on sheet Processor; HelpURL: https://media.digikey.com/pdf/Data%20Sheets/Samsung%20PDFs/CL05A106MP5NUNC_Spec.pdf; CreatedBy: Judd Foster
C612 C613 = CAP,Cer,1uF,35VDC,X5R,0402: as C504 on sheet Processor; HelpURL: https://product.tdk.com/info/en/catalog/datasheets/mlcc_commercial_general_en.pdf?ref_disty=digikey; CreatedBy: Judd Foster
D600 D601 = LED,Green,SMD,0603: as D500 on sheet Processor; CreatedBy: Judd Foster; HelpURL: http://www.stanley-components.com/php/downloaddatafile.php?rp=0,THG1111C-0005_e.pdf
D602-D604 = DIODE,Schottky,40V,3A,SMD: Diode Schottky 40V 3A Surface Mount CFP5; Manufacturer: Nexperia USA Inc.; Vendor Part Number: 1727-5841-1-ND; Vendor: Digikey; CreatedBy: Judd Foster; HelpURL: https://assets.nexperia.com/documents/data-sheet/PMEG4030EP.pdf; Manufacturer Part Number: PMEG4030EP,115
J600 = Conn,JST,2Pin,2mm,SMD: Connector Header Surface Mount, Right Angle 2 position 0.079" (2.00mm); Vendor Part Number: H125443CT-ND; Manufacturer: Hirose Electric Co Ltd; Manufacturer Part Number: DF3EA-2P-2H(21); Vendor: Digikey; HelpURL: https://www.hirose.com/product/document?clcode=CL0543-0329-0-21&productname=DF3EA-2P-2H(21)&series=DF3&documenttype=2DDrawing&lang=en&documentid=0001258196; Created By: Judd Foster
L600-L602 = IND,4.7uH,2.6A,Wirewound,SMD: 4.7µH Shielded Wirewound Inductor 2.6A 45.5mOhm Max Nonstandard; Vendor Part Number: 587-3605-1-ND; Manufacturer: Taiyo Yuden; Manufacturer Part Number: NRS5030T4R7MMGJV; Vendor: Digikey; HelpURL: https://ds.yuden.co.jp/TYCOMPAS/ut/detail?pn=NRS5030T4R7MMGJV%20%20&u=M; CreatedBy: Judd Foster
L603 = Ferrite,470R@100MHz,0402: as L800 on sheet USB_Serial; HelpURL: https://www.murata.com/en-us/products/productdata/8796740059166/ENFA0018.pdf; CreatedBy: Judd Foster
Q600 Q601 = MOSFET,P Ch,20V,3.2A: as Q100 on sheet Inertial_Measurement_RTC; CreatedBy: Judd Foster; HelpURL: https://media.digikey.com/pdf/Data%20Sheets/Diodes%20PDFs/DMP2160U.pdf; Manufacturer Part Number: DMP2160U-7
Q602 Q603 = Trans,NPN,40V,200mA,SOT1123: as Q800 on sheet USB_Serial; CreatedBy: Judd Foster; HelpURL: https://www.onsemi.com/pdf/datasheet/nst3904f3-d.pdf; Manufacturer Part Number: NST3904F3T5G
Q604 = MOSFET,N Ch,30V,10A: N-Channel 30 V 10A (Ta) 2.1W (Ta) Surface Mount DFN2020MD-6; Manufacturer: Nexperia USA Inc.; Vendor Part Number: 1727-7662-1-ND; Vendor: Digikey; CreatedBy: Ritesh Nandakumar; HelpURL: https://assets.nexperia.com/documents/data-sheet/PMPB25ENE.pdf; Manufacturer Part Number: PMPB25ENEX
R600 R601 R607 = RES,300k,1%,0.063W,0402: as R203 on sheet Load_Cell_Acquisition; CreatedBy: Judd Foster; HelpURL: https://www.seielect.com/catalog/sei-rmcf_rmcp.pdf
R602 R603 = RES,560R,1%,0.063W,0402: as R204 on sheet Load_Cell_Acquisition; CreatedBy: Judd Foster; HelpURL: https://www.te.com/commerce/DocumentDelivery/DDEController?Action=srchrtrv&DocNm=1773204-3&DocType=DS&DocLang=English
R604 R608-R611 R616 R619-R624 = RES,10k,5%,0.063W,0402: as R500 on sheet Processor; HelpURL: https://www.seielect.com/catalog/sei-rmcf_rmcp.pdf; CreatedBy: Judd Foster
R605 = RES,50m,1%,0.5W,1206: 50 mOhms ±1% 0.5W, 1/2W Chip Resistor 1206 (3216 Metric) Current Sense Metal Film; Manufacturer: Ohmite; Manufacturer Part Number: KDV12FR050ET; Vendor Part Number: 273-KDV12FR050ETCT-ND; Vendor: Digikey; CreatedBy: Judd Foster; HelpURL: https://www.ohmite.com/assets/docs/res_kdv.pdf?r=false
R606 = RES,150k,1%,0.1W,0402: 150 kOhms ±1% 0.063W, 1/16W Chip Resistor 0402 (1005 Metric) Automotive AEC-Q200 Thick Film; Manufacturer: Stackpole Electronics Inc; Manufacturer Part Number: RMCF0402FT150K; Vendor Part Number: RMCF0402FT150KCT-ND; Vendor: Digikey; CreatedBy: Judd Foster; HelpURL: https://www.seielect.com/catalog/sei-rmcf_rmcp.pdf
R612 R614 R617 R618 = RES,100k,5%,0.1W,0402: 100 kOhms ±5% 0.1W, 1/10W Chip Resistor 0402 (1005 Metric) Automotive AEC-Q200 Thick Film; Manufacturer: Panasonic Electronic Components; Manufacturer Part Number: ERJ-2GEJ104X; Vendor Part Number: P100KJCT-ND; Vendor: Digikey; CreatedBy: Judd Foster; HelpURL: https://b2b-api.panasonic.eu/file_stream/pids/fileversion/1242
R613 = RES,Thermistor,3380K,0402: NTC Thermistor 10k 0402 (1005 Metric); Manufacturer: Murata Electronics; Manufacturer Part Number: NCU15XH103J6SRC; Vendor Part Number: 490-NCU15XH103J6SRCCT-ND; Vendor: Digikey; CreatedBy: Judd Foster; HelpURL: https://www.murata.com/en-us/api/pdfdownloadapi?cate=luNTCforTempeSenso&partno=NCU15XH103J6SRC
R615 = RES,10R,1%,0.063W,0402: as R301 on sheet Load_Cell_Biasing; CreatedBy: Judd Foster; HelpURL: https://industrial.panasonic.com/cdbs/www-data/pdf/RDA0000/AOA0000C304.pdf
TP600-TP609 = TESTPOINT: PCB Testpoint; CreatedBy: Judd Foster; HelpURL: N/A; Manufacturer: N/A; Manufacturer Part Number: N/A; Vendor: N/A; Vendor Part Number: N/A
U600 = MP2615AGQ-Z: Charger IC Lithium Ion/Polymer 16-QFN (3x3); Manufacturer: Monolithic Power Systems Inc.; Vendor Part Number: 1589-MP2615AGQ-ZCT-ND; Vendor: Digikey; CreatedBy: Judd Foster; HelpURL: https://www.monolithicpower.com/en/documentview/productdocument/index/version/2/document_type/Datasheet/lang/en/sku/MP2615AGQ-Z/document_id/1433/; Manufacturer Part Number: MP2615AGQ-Z
U601 = LM2623AMM/NOPB: Boost Switching Regulator IC Positive Adjustable 1.24V 1 Output 2.2A (Switch) 8-TSSOP, 8-MSOP (0.118", 3.00mm Width); Vendor Part Number: LM2623AMM/NOPBCT-ND; Manufacturer: Texas Instruments; Vendor: Digikey; Manufacturer Part Number: LM2623AMM/NOPB; HelpURL: https://www.ti.com/general/docs/suppproductinfo.tsp?distId=10&gotoUrl=https%3A%2F%2Fwww.ti.com%2Flit%2Fgpn%2Flm2623; CreatedBy: Judd Foster
U602 = RP506K331B-TR: Buck Switching Regulator IC Positive Fixed 3.3V 1 Output 2A 10-UFDFN Exposed Pad; Manufacturer: Nisshinbo Micro Devices Inc.; Vendor Part Number: 2129-RP506K331B-CT-ND; Vendor: Digikey; CreatedBy: Judd Foster; HelpURL: https://www.nisshinbo-microdevices.co.jp/en/pdf/datasheet/rp506-ea.pdf; Manufacturer Part Number: RP506K331B-TR